# Altium project 724452_RPL-HX_Mobile_AEP_Rev0p91.PrjPcb (part 6 of 13)

## Sheet 0040_GPP_I_J_K_R_S.SchDoc
size A3
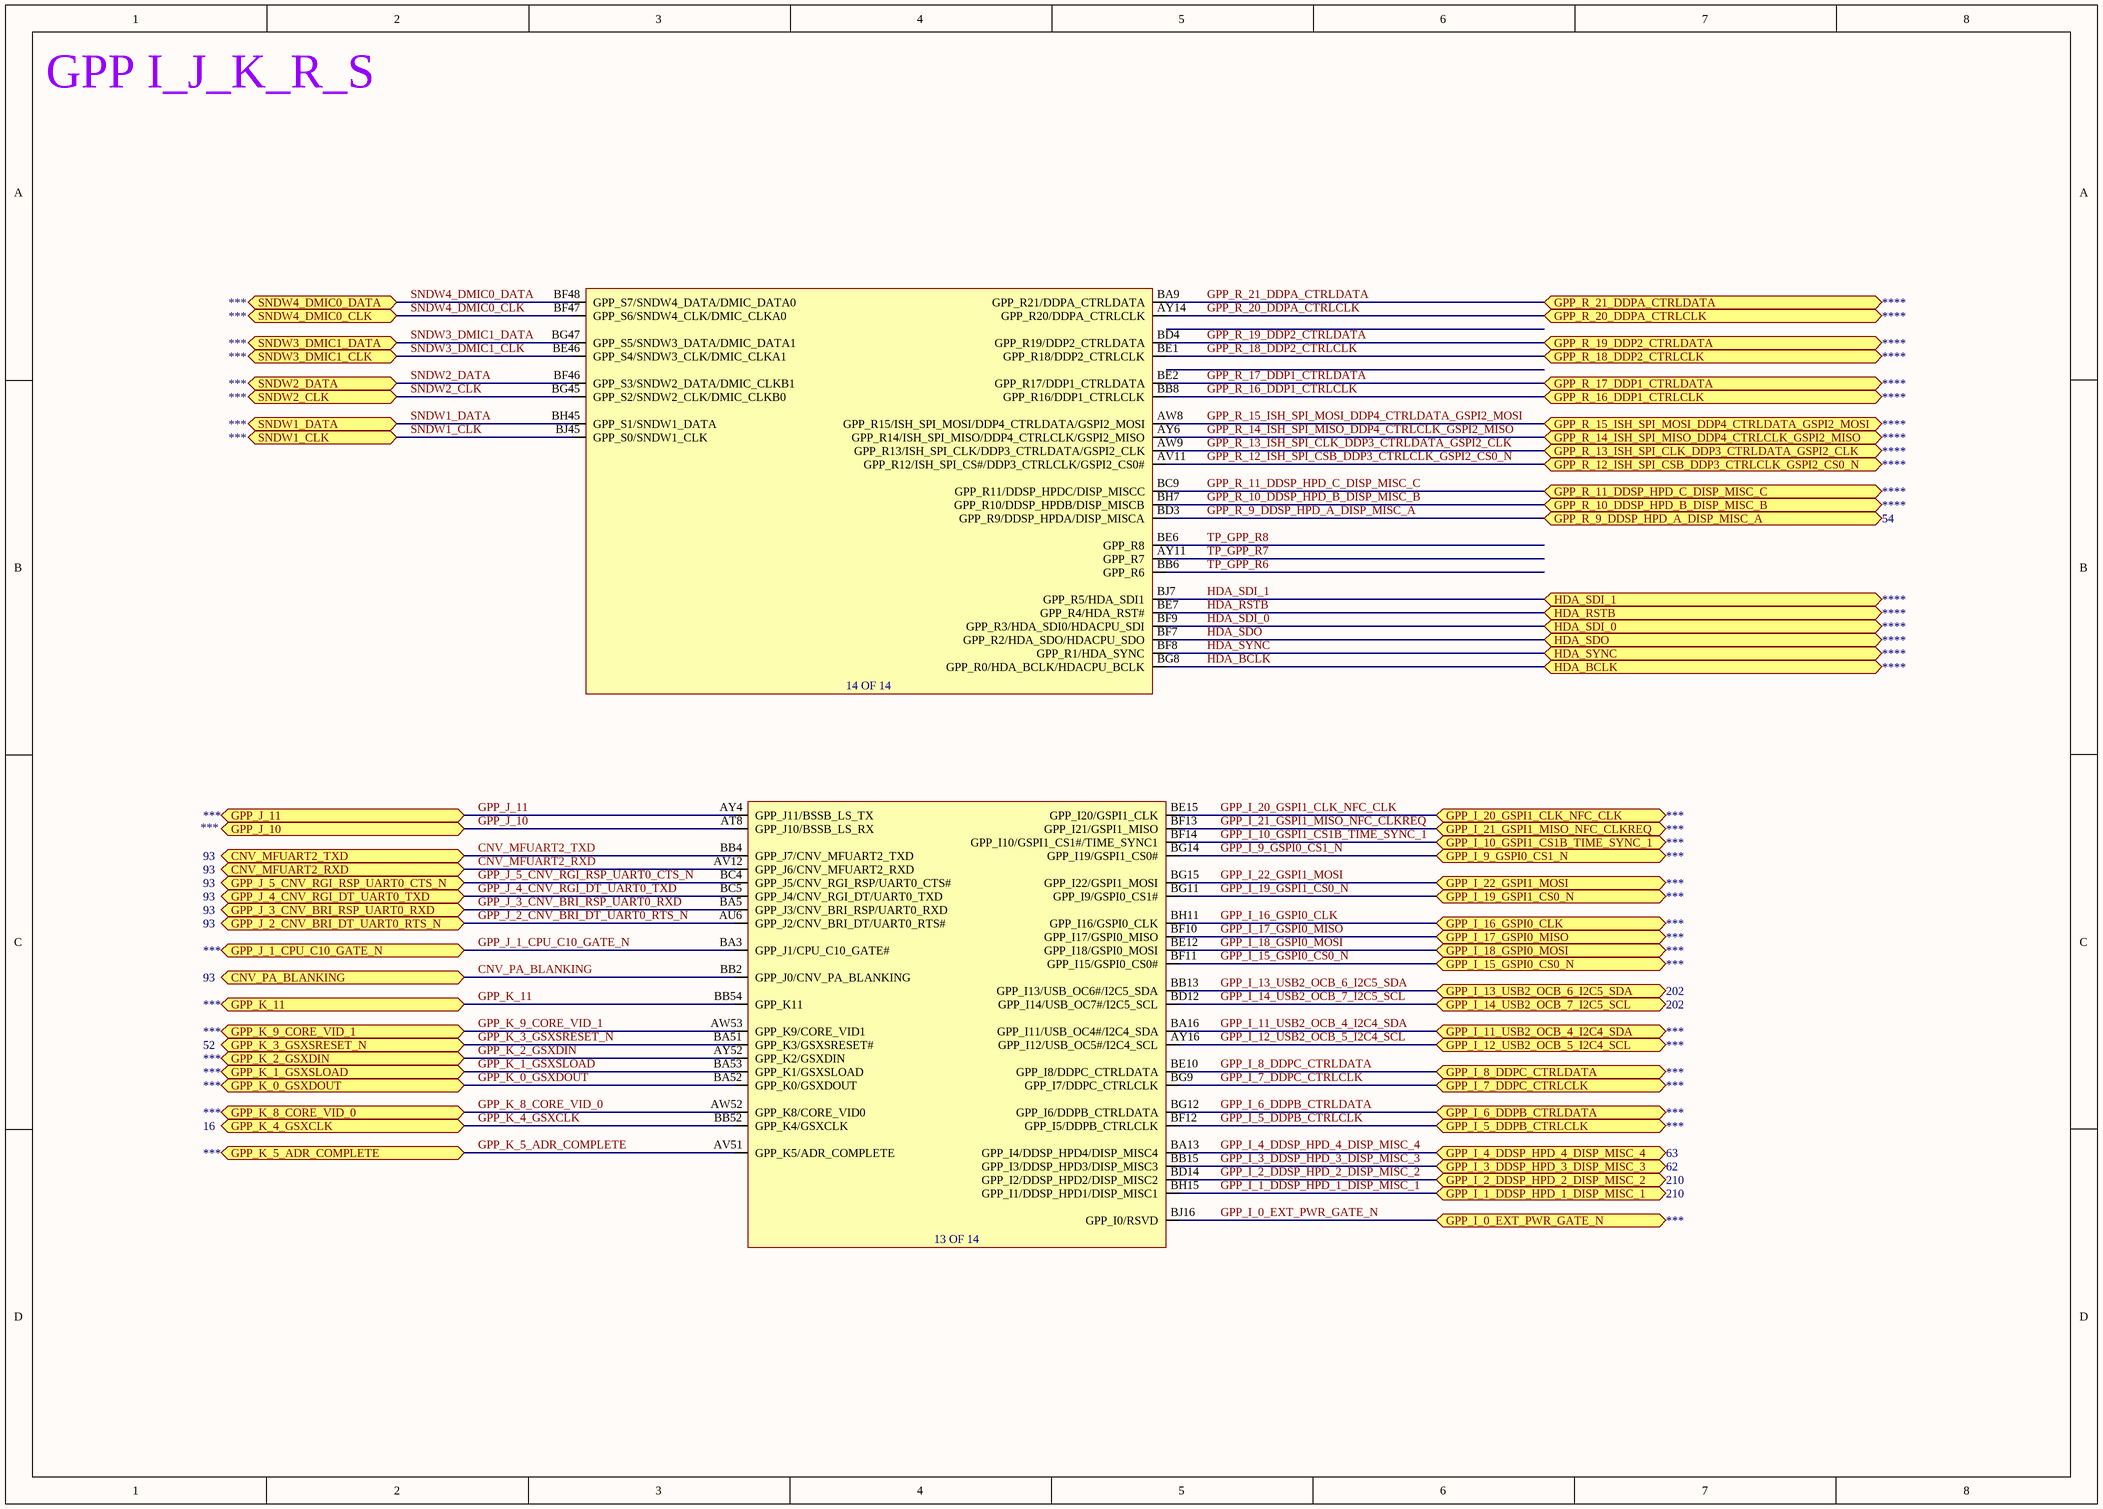
[diagram p66: 0040_GPP_I_J_K_R_S.SchDoc]

### Parts
U23601  C_RPL_S_PCH_EXT  (value not drawn)  (parts M,N of 14)

### Ports
CNV_MFUART2_RXD (bidir), CNV_MFUART2_TXD (bidir), CNV_PA_BLANKING (bidir), GPP_I_0_EXT_PWR_GATE_N (bidir), GPP_I_1_DDSP_HPD_1_DISP_MISC_1 (bidir), GPP_I_2_DDSP_HPD_2_DISP_MISC_2 (bidir), GPP_I_3_DDSP_HPD_3_DISP_MISC_3 (bidir), GPP_I_4_DDSP_HPD_4_DISP_MISC_4 (bidir), GPP_I_5_DDPB_CTRLCLK (bidir), GPP_I_6_DDPB_CTRLDATA (bidir), GPP_I_7_DDPC_CTRLCLK (bidir), GPP_I_8_DDPC_CTRLDATA (bidir), GPP_I_9_GSPI0_CS1_N (bidir), GPP_I_10_GSPI1_CS1B_TIME_SYNC_1 (bidir), GPP_I_11_USB2_OCB_4_I2C4_SDA (bidir), GPP_I_12_USB2_OCB_5_I2C4_SCL (bidir), GPP_I_13_USB2_OCB_6_I2C5_SDA (bidir), GPP_I_14_USB2_OCB_7_I2C5_SCL (bidir), GPP_I_15_GSPI0_CS0_N (bidir), GPP_I_16_GSPI0_CLK (bidir), GPP_I_17_GSPI0_MISO (bidir), GPP_I_18_GSPI0_MOSI (bidir), GPP_I_19_GSPI1_CS0_N (bidir), GPP_I_20_GSPI1_CLK_NFC_CLK (bidir), GPP_I_21_GSPI1_MISO_NFC_CLKREQ (bidir), GPP_I_22_GSPI1_MOSI (bidir), GPP_J_1_CPU_C10_GATE_N (bidir), GPP_J_2_CNV_BRI_DT_UART0_RTS_N (bidir), GPP_J_3_CNV_BRI_RSP_UART0_RXD (bidir), GPP_J_4_CNV_RGI_DT_UART0_TXD (bidir), GPP_J_5_CNV_RGI_RSP_UART0_CTS_N (bidir), GPP_J_10 (bidir), GPP_J_11 (bidir), GPP_K_0_GSXDOUT (bidir), GPP_K_1_GSXSLOAD (bidir), GPP_K_2_GSXDIN (bidir), GPP_K_3_GSXSRESET_N (bidir), GPP_K_4_GSXCLK (bidir), GPP_K_5_ADR_COMPLETE (bidir), GPP_K_8_CORE_VID_0 (bidir), GPP_K_9_CORE_VID_1 (bidir), GPP_K_11 (bidir), GPP_R_9_DDSP_HPD_A_DISP_MISC_A (bidir), GPP_R_10_DDSP_HPD_B_DISP_MISC_B (bidir), GPP_R_11_DDSP_HPD_C_DISP_MISC_C (bidir), GPP_R_12_ISH_SPI_CSB_DDP3_CTRLCLK_GSPI2_CS0_N (bidir), GPP_R_13_ISH_SPI_CLK_DDP3_CTRLDATA_GSPI2_CLK (bidir), GPP_R_14_ISH_SPI_MISO_DDP4_CTRLCLK_GSPI2_MISO (bidir), GPP_R_15_ISH_SPI_MOSI_DDP4_CTRLDATA_GSPI2_MOSI (bidir), GPP_R_16_DDP1_CTRLCLK (bidir), GPP_R_17_DDP1_CTRLDATA (bidir), GPP_R_18_DDP2_CTRLCLK (bidir), GPP_R_19_DDP2_CTRLDATA (bidir), GPP_R_20_DDPA_CTRLCLK (bidir), GPP_R_21_DDPA_CTRLDATA (bidir), HDA_BCLK (bidir), HDA_RSTB (bidir), HDA_SDI_0 (bidir), HDA_SDI_1 (bidir), HDA_SDO (bidir), HDA_SYNC (bidir), SNDW1_CLK (bidir), SNDW1_DATA (bidir), SNDW2_CLK (bidir), SNDW2_DATA (bidir), SNDW3_DMIC1_CLK (bidir), SNDW3_DMIC1_DATA (bidir), SNDW4_DMIC0_CLK (bidir), SNDW4_DMIC0_DATA (bidir)

### Nets
CNV_MFUART2_RXD: U23601.AV12(GPP_J6/CNV_MFUART2_RXD) ; port CNV_MFUART2_RXD
CNV_MFUART2_TXD: U23601.BB4(GPP_J7/CNV_MFUART2_TXD) ; port CNV_MFUART2_TXD
CNV_PA_BLANKING: U23601.BB2(GPP_J0/CNV_PA_BLANKING) ; port CNV_PA_BLANKING
GPP_I_0_EXT_PWR_GATE_N: U23601.BJ16(GPP_I0/RSVD) ; port GPP_I_0_EXT_PWR_GATE_N
GPP_I_1_DDSP_HPD_1_DISP_MISC_1: U23601.BH15(GPP_I1/DDSP_HPD1/DISP_MISC1) ; port GPP_I_1_DDSP_HPD_1_DISP_MISC_1
GPP_I_2_DDSP_HPD_2_DISP_MISC_2: U23601.BD14(GPP_I2/DDSP_HPD2/DISP_MISC2) ; port GPP_I_2_DDSP_HPD_2_DISP_MISC_2
GPP_I_3_DDSP_HPD_3_DISP_MISC_3: U23601.BB15(GPP_I3/DDSP_HPD3/DISP_MISC3) ; port GPP_I_3_DDSP_HPD_3_DISP_MISC_3
GPP_I_4_DDSP_HPD_4_DISP_MISC_4: U23601.BA13(GPP_I4/DDSP_HPD4/DISP_MISC4) ; port GPP_I_4_DDSP_HPD_4_DISP_MISC_4  [project net GPP_I_3_DDSP_HPD_3_DISP_MISC_3]
GPP_I_5_DDPB_CTRLCLK: U23601.BF12(GPP_I5/DDPB_CTRLCLK) ; port GPP_I_5_DDPB_CTRLCLK
GPP_I_6_DDPB_CTRLDATA: U23601.BG12(GPP_I6/DDPB_CTRLDATA) ; port GPP_I_6_DDPB_CTRLDATA
GPP_I_7_DDPC_CTRLCLK: U23601.BG9(GPP_I7/DDPC_CTRLCLK) ; port GPP_I_7_DDPC_CTRLCLK
GPP_I_8_DDPC_CTRLDATA: U23601.BE10(GPP_I8/DDPC_CTRLDATA) ; port GPP_I_8_DDPC_CTRLDATA
GPP_I_9_GSPI0_CS1_N: U23601.BG14(GPP_I19/GSPI1_CS0#) ; port GPP_I_9_GSPI0_CS1_N
GPP_I_10_GSPI1_CS1B_TIME_SYNC_1: U23601.BF14(GPP_I10/GSPI1_CS1#/TIME_SYNC1) ; port GPP_I_10_GSPI1_CS1B_TIME_SYNC_1
GPP_I_11_USB2_OCB_4_I2C4_SDA: U23601.BA16(GPP_I11/USB_OC4#/I2C4_SDA) ; port GPP_I_11_USB2_OCB_4_I2C4_SDA
GPP_I_12_USB2_OCB_5_I2C4_SCL: U23601.AY16(GPP_I12/USB_OC5#/I2C4_SCL) ; port GPP_I_12_USB2_OCB_5_I2C4_SCL
GPP_I_13_USB2_OCB_6_I2C5_SDA: U23601.BB13(GPP_I13/USB_OC6#/I2C5_SDA) ; port GPP_I_13_USB2_OCB_6_I2C5_SDA
GPP_I_14_USB2_OCB_7_I2C5_SCL: U23601.BD12(GPP_I14/USB_OC7#/I2C5_SCL) ; port GPP_I_14_USB2_OCB_7_I2C5_SCL
GPP_I_15_GSPI0_CS0_N: U23601.BF11(GPP_I15/GSPI0_CS0#) ; port GPP_I_15_GSPI0_CS0_N
GPP_I_16_GSPI0_CLK: U23601.BH11(GPP_I16/GSPI0_CLK) ; port GPP_I_16_GSPI0_CLK
GPP_I_17_GSPI0_MISO: U23601.BF10(GPP_I17/GSPI0_MISO) ; port GPP_I_17_GSPI0_MISO
GPP_I_18_GSPI0_MOSI: U23601.BE12(GPP_I18/GSPI0_MOSI) ; port GPP_I_18_GSPI0_MOSI
GPP_I_19_GSPI1_CS0_N: U23601.BG11(GPP_I9/GSPI0_CS1#) ; port GPP_I_19_GSPI1_CS0_N
GPP_I_20_GSPI1_CLK_NFC_CLK: U23601.BE15(GPP_I20/GSPI1_CLK) ; port GPP_I_20_GSPI1_CLK_NFC_CLK
GPP_I_21_GSPI1_MISO_NFC_CLKREQ: U23601.BF13(GPP_I21/GSPI1_MISO) ; port GPP_I_21_GSPI1_MISO_NFC_CLKREQ
GPP_I_22_GSPI1_MOSI: U23601.BG15(GPP_I22/GSPI1_MOSI) ; port GPP_I_22_GSPI1_MOSI
GPP_J_1_CPU_C10_GATE_N: U23601.BA3(GPP_J1/CPU_C10_GATE#) ; port GPP_J_1_CPU_C10_GATE_N
GPP_J_2_CNV_BRI_DT_UART0_RTS_N: U23601.AU6(GPP_J2/CNV_BRI_DT/UART0_RTS#) ; port GPP_J_2_CNV_BRI_DT_UART0_RTS_N
GPP_J_3_CNV_BRI_RSP_UART0_RXD: U23601.BA5(GPP_J3/CNV_BRI_RSP/UART0_RXD) ; port GPP_J_3_CNV_BRI_RSP_UART0_RXD
GPP_J_4_CNV_RGI_DT_UART0_TXD: U23601.BC5(GPP_J4/CNV_RGI_DT/UART0_TXD) ; port GPP_J_4_CNV_RGI_DT_UART0_TXD
GPP_J_5_CNV_RGI_RSP_UART0_CTS_N: U23601.BC4(GPP_J5/CNV_RGI_RSP/UART0_CTS#) ; port GPP_J_5_CNV_RGI_RSP_UART0_CTS_N
GPP_J_10: U23601.AT8(GPP_J10/BSSB_LS_RX) ; port GPP_J_10
GPP_J_11: U23601.AY4(GPP_J11/BSSB_LS_TX) ; port GPP_J_11
GPP_K_0_GSXDOUT: U23601.BA52(GPP_K0/GSXDOUT) ; port GPP_K_0_GSXDOUT
GPP_K_1_GSXSLOAD: U23601.BA53(GPP_K1/GSXSLOAD) ; port GPP_K_1_GSXSLOAD
GPP_K_2_GSXDIN: U23601.AY52(GPP_K2/GSXDIN) ; port GPP_K_2_GSXDIN
GPP_K_3_GSXSRESET_N: U23601.BA51(GPP_K3/GSXSRESET#) ; port GPP_K_3_GSXSRESET_N
GPP_K_4_GSXCLK: U23601.BB52(GPP_K4/GSXCLK) ; port GPP_K_4_GSXCLK
GPP_K_5_ADR_COMPLETE: U23601.AV51(GPP_K5/ADR_COMPLETE) ; port GPP_K_5_ADR_COMPLETE
GPP_K_8_CORE_VID_0: U23601.AW52(GPP_K8/CORE_VID0) ; port GPP_K_8_CORE_VID_0
GPP_K_9_CORE_VID_1: U23601.AW53(GPP_K9/CORE_VID1) ; port GPP_K_9_CORE_VID_1
GPP_K_11: U23601.BB54(GPP_K11) ; port GPP_K_11
GPP_R_9_DDSP_HPD_A_DISP_MISC_A: U23601.BD3(GPP_R9/DDSP_HPDA/DISP_MISCA) ; port GPP_R_9_DDSP_HPD_A_DISP_MISC_A
GPP_R_10_DDSP_HPD_B_DISP_MISC_B: U23601.BH7(GPP_R10/DDSP_HPDB/DISP_MISCB) ; port GPP_R_10_DDSP_HPD_B_DISP_MISC_B
GPP_R_11_DDSP_HPD_C_DISP_MISC_C: U23601.BC9(GPP_R11/DDSP_HPDC/DISP_MISCC) ; port GPP_R_11_DDSP_HPD_C_DISP_MISC_C
GPP_R_12_ISH_SPI_CSB_DDP3_CTRLCLK_GSPI2_CS0_N: U23601.AV11(GPP_R12/ISH_SPI_CS#/DDP3_CTRLCLK/GSPI2_CS0#) ; port GPP_R_12_ISH_SPI_CSB_DDP3_CTRLCLK_GSPI2_CS0_N
GPP_R_13_ISH_SPI_CLK_DDP3_CTRLDATA_GSPI2_CLK: U23601.AW9(GPP_R13/ISH_SPI_CLK/DDP3_CTRLDATA/GSPI2_CLK) ; port GPP_R_13_ISH_SPI_CLK_DDP3_CTRLDATA_GSPI2_CLK
GPP_R_14_ISH_SPI_MISO_DDP4_CTRLCLK_GSPI2_MISO: U23601.AY6(GPP_R14/ISH_SPI_MISO/DDP4_CTRLCLK/GSPI2_MISO) ; port GPP_R_14_ISH_SPI_MISO_DDP4_CTRLCLK_GSPI2_MISO
GPP_R_15_ISH_SPI_MOSI_DDP4_CTRLDATA_GSPI2_MOSI: U23601.AW8(GPP_R15/ISH_SPI_MOSI/DDP4_CTRLDATA/GSPI2_MOSI) ; port GPP_R_15_ISH_SPI_MOSI_DDP4_CTRLDATA_GSPI2_MOSI
GPP_R_16_DDP1_CTRLCLK: U23601.BB8(GPP_R16/DDP1_CTRLCLK) ; port GPP_R_16_DDP1_CTRLCLK
GPP_R_17_DDP1_CTRLDATA: U23601.BE2(GPP_R17/DDP1_CTRLDATA) ; port GPP_R_17_DDP1_CTRLDATA
GPP_R_18_DDP2_CTRLCLK: U23601.BE1(GPP_R18/DDP2_CTRLCLK) ; port GPP_R_18_DDP2_CTRLCLK
GPP_R_19_DDP2_CTRLDATA: U23601.BD4(GPP_R19/DDP2_CTRLDATA) ; port GPP_R_19_DDP2_CTRLDATA
GPP_R_20_DDPA_CTRLCLK: U23601.AY14(GPP_R20/DDPA_CTRLCLK) ; port GPP_R_20_DDPA_CTRLCLK
GPP_R_21_DDPA_CTRLDATA: U23601.BA9(GPP_R21/DDPA_CTRLDATA) ; port GPP_R_21_DDPA_CTRLDATA
HDA_BCLK: U23601.BG8(GPP_R0/HDA_BCLK/HDACPU_BCLK) ; port HDA_BCLK
HDA_RSTB: U23601.BE7(GPP_R4/HDA_RST#) ; port HDA_RSTB
HDA_SDI_0: U23601.BF9(GPP_R3/HDA_SDI0/HDACPU_SDI) ; port HDA_SDI_0
HDA_SDI_1: U23601.BJ7(GPP_R5/HDA_SDI1) ; port HDA_SDI_1
HDA_SDO: U23601.BF7(GPP_R2/HDA_SDO/HDACPU_SDO) ; port HDA_SDO
HDA_SYNC: U23601.BF8(GPP_R1/HDA_SYNC) ; port HDA_SYNC
SNDW1_CLK: U23601.BJ45(GPP_S0/SNDW1_CLK) ; port SNDW1_CLK
SNDW1_DATA: U23601.BH45(GPP_S1/SNDW1_DATA) ; port SNDW1_DATA
SNDW2_CLK: U23601.BG45(GPP_S2/SNDW2_CLK/DMIC_CLKB0) ; port SNDW2_CLK
SNDW2_DATA: U23601.BF46(GPP_S3/SNDW2_DATA/DMIC_CLKB1) ; port SNDW2_DATA
SNDW3_DMIC1_CLK: U23601.BE46(GPP_S4/SNDW3_CLK/DMIC_CLKA1) ; port SNDW3_DMIC1_CLK
SNDW3_DMIC1_DATA: U23601.BG47(GPP_S5/SNDW3_DATA/DMIC_DATA1) ; port SNDW3_DMIC1_DATA
SNDW4_DMIC0_CLK: U23601.BF47(GPP_S6/SNDW4_CLK/DMIC_CLKA0) ; port SNDW4_DMIC0_CLK
SNDW4_DMIC0_DATA: U23601.BF48(GPP_S7/SNDW4_DATA/DMIC_DATA0) ; port SNDW4_DMIC0_DATA
TP_GPP_R6: U23601.BB6(GPP_R6)
TP_GPP_R7: U23601.AY11(GPP_R7)
TP_GPP_R8: U23601.BE6(GPP_R8)

### Notes on the sheet
- GPP I_J_K_R_S
- (in symbol C_RPL_S_PCH_EXT, part M) 13 OF 14
- (in symbol C_RPL_S_PCH_EXT, part N) 14 OF 14

### Library data of the parts
U23601 = C_RPL_S_PCH_EXT: Manufacturer Part Number: *; Case/Package: *

## Sheet 0041_PCH_PWR_GND.SchDoc
size 848 x 558 mm
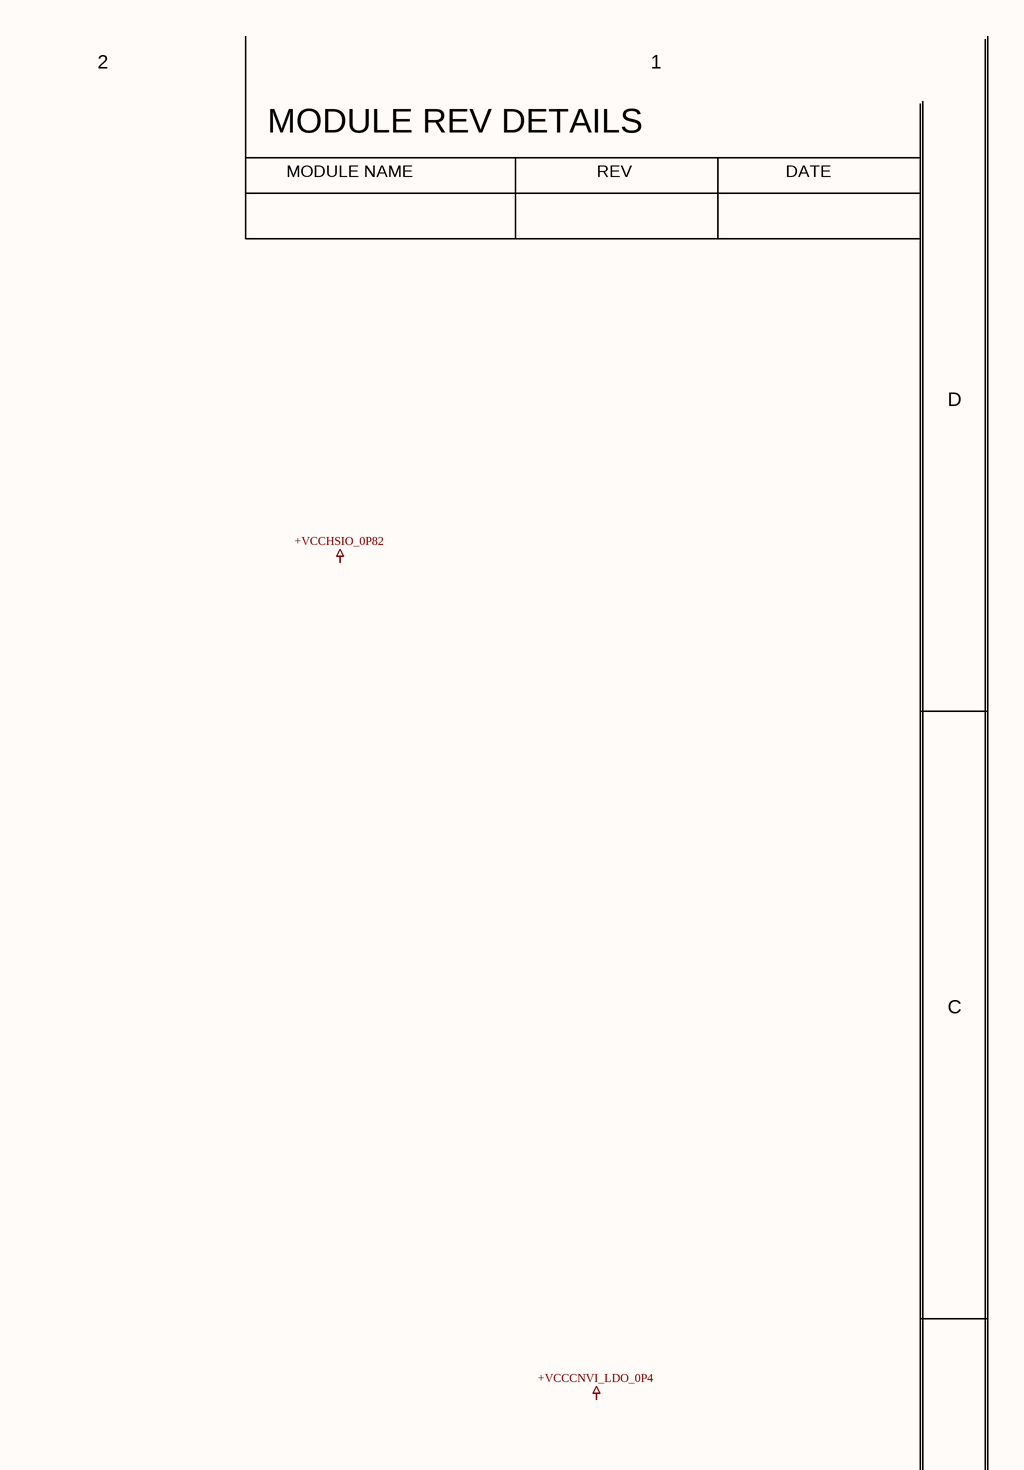
[diagram p67: 0041_PCH_PWR_GND.SchDoc, top right]
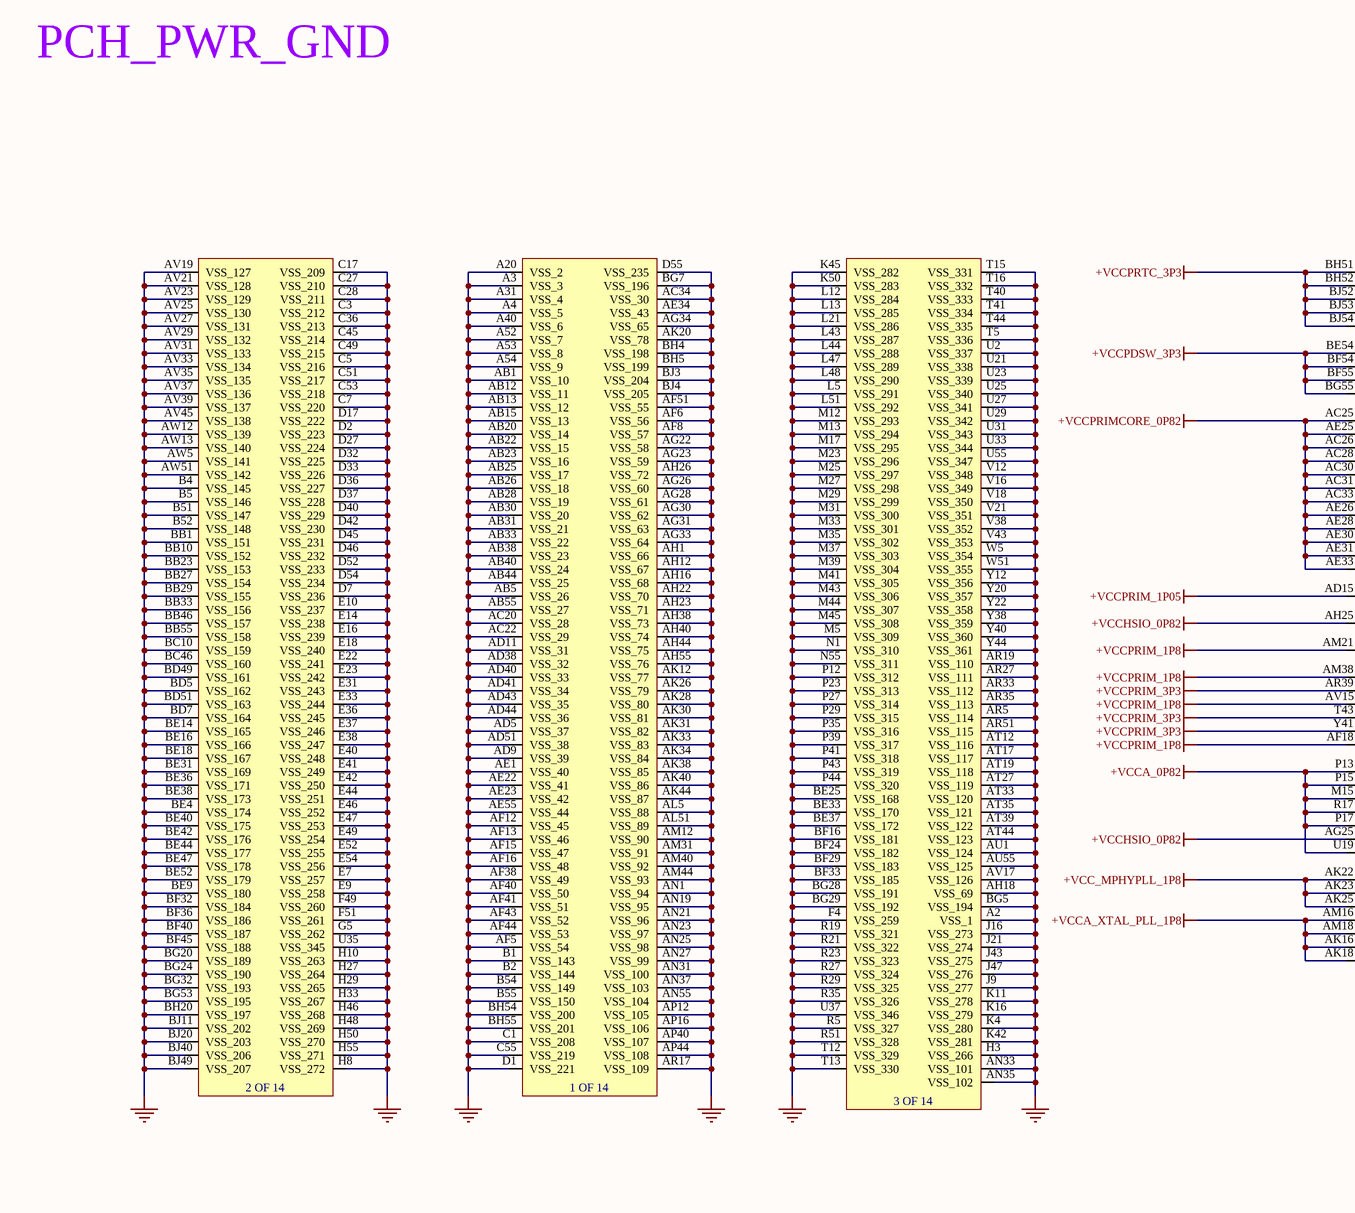
[diagram p68: 0041_PCH_PWR_GND.SchDoc, bottom left]
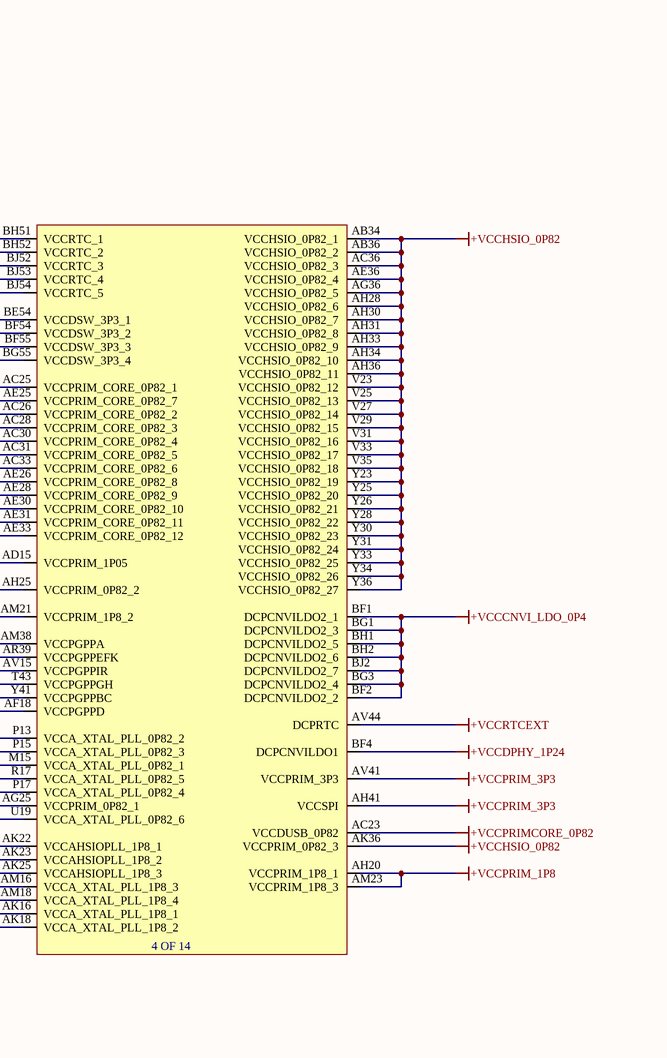
[diagram p69: 0041_PCH_PWR_GND.SchDoc, bottom middle]
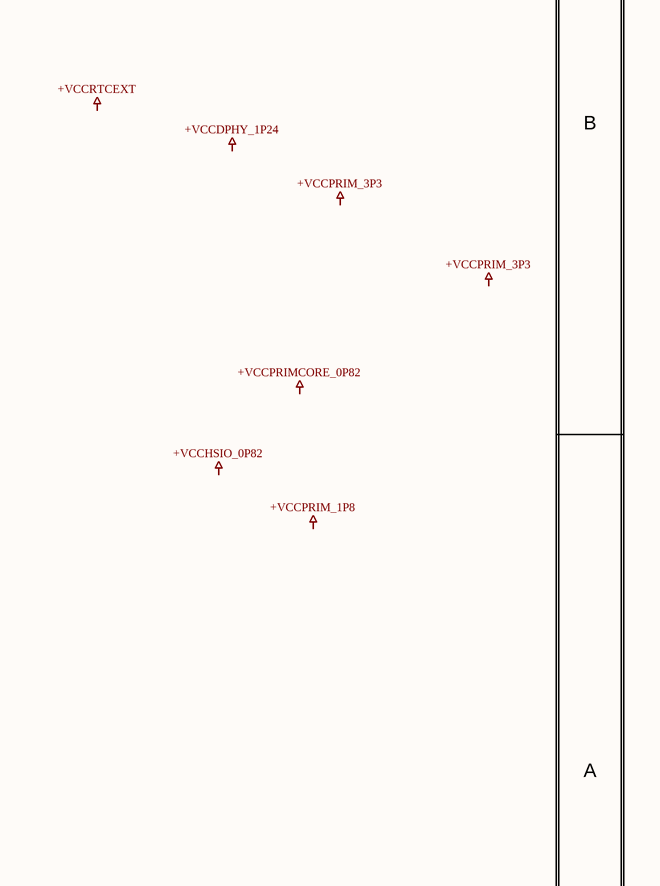
[diagram p70: 0041_PCH_PWR_GND.SchDoc, bottom right]

### Parts
(Parts that share a designator on the sheet are numbered #1, #2 ... from top to bottom, then left to right.)
U23601  C_RPL_S_PCH_EXT  (value not drawn)  (parts A,B,C of 14)
U?#4  C_RPL_S_PCH_EXT  (value not drawn)  (part D of 14)

### Nets
+VCC_MPHYPLL_1P8: U?#4.AK22(VCCAHSIOPLL_1P8_1) U?#4.AK23(VCCAHSIOPLL_1P8_2) U?#4.AK25(VCCAHSIOPLL_1P8_3)
+VCCA_0P82: U?#4.M15(VCCA_XTAL_PLL_0P82_1) U?#4.P13(VCCA_XTAL_PLL_0P82_2) U?#4.P15(VCCA_XTAL_PLL_0P82_3) U?#4.P17(VCCA_XTAL_PLL_0P82_4) U?#4.R17(VCCA_XTAL_PLL_0P82_5) U?#4.U19(VCCA_XTAL_PLL_0P82_6)
+VCCA_XTAL_PLL_1P8: U?#4.AK16(VCCA_XTAL_PLL_1P8_1) U?#4.AK18(VCCA_XTAL_PLL_1P8_2) U?#4.AM16(VCCA_XTAL_PLL_1P8_3) U?#4.AM18(VCCA_XTAL_PLL_1P8_4)
+VCCCNVI_LDO_0P4: U?#4.BF1(DCPCNVILDO2_1) U?#4.BF2(DCPCNVILDO2_2) U?#4.BG1(DCPCNVILDO2_3) U?#4.BG3(DCPCNVILDO2_4) U?#4.BH1(DCPCNVILDO2_5) U?#4.BH2(DCPCNVILDO2_6) U?#4.BJ2(DCPCNVILDO2_7)
+VCCDPHY_1P24: U?#4.BF4(DCPCNVILDO1)
+VCCHSIO_0P82: U?#4.AB34(VCCHSIO_0P82_1) U?#4.AB36(VCCHSIO_0P82_2) U?#4.AC36(VCCHSIO_0P82_3) U?#4.AE36(VCCHSIO_0P82_4) U?#4.AG25(VCCPRIM_0P82_1) U?#4.AG36(VCCHSIO_0P82_5) U?#4.AH25(VCCPRIM_0P82_2) U?#4.AH28(VCCHSIO_0P82_6) U?#4.AH30(VCCHSIO_0P82_7) U?#4.AH31(VCCHSIO_0P82_8) U?#4.AH33(VCCHSIO_0P82_9) U?#4.AH34(VCCHSIO_0P82_10) U?#4.AH36(VCCHSIO_0P82_11) U?#4.AK36(VCCPRIM_0P82_3) U?#4.V23(VCCHSIO_0P82_12) U?#4.V25(VCCHSIO_0P82_13) U?#4.V27(VCCHSIO_0P82_14) U?#4.V29(VCCHSIO_0P82_15) U?#4.V31(VCCHSIO_0P82_16) U?#4.V33(VCCHSIO_0P82_17) U?#4.V35(VCCHSIO_0P82_18) U?#4.Y23(VCCHSIO_0P82_19) U?#4.Y25(VCCHSIO_0P82_20) U?#4.Y26(VCCHSIO_0P82_21) U?#4.Y28(VCCHSIO_0P82_22) U?#4.Y30(VCCHSIO_0P82_23) U?#4.Y31(VCCHSIO_0P82_24) U?#4.Y33(VCCHSIO_0P82_25) U?#4.Y34(VCCHSIO_0P82_26) U?#4.Y36(VCCHSIO_0P82_27)
+VCCPDSW_3P3: U?#4.BE54(VCCDSW_3P3_1) U?#4.BF54(VCCDSW_3P3_2) U?#4.BF55(VCCDSW_3P3_3) U?#4.BG55(VCCDSW_3P3_4)
+VCCPRIM_1P05: U?#4.AD15(VCCPRIM_1P05)
+VCCPRIM_1P8: U?#4.AF18(VCCPGPPD) U?#4.AH20(VCCPRIM_1P8_1) U?#4.AM21(VCCPRIM_1P8_2) U?#4.AM23(VCCPRIM_1P8_3) U?#4.AM38(VCCPGPPA) U?#4.AV15(VCCPGPPIR)
+VCCPRIM_3P3: U?#4.AH41(VCCSPI) U?#4.AR39(VCCPGPPEFK) U?#4.AV41(VCCPRIM_3P3) U?#4.T43(VCCPGPPGH) U?#4.Y41(VCCPGPPBC)
+VCCPRIMCORE_0P82: U?#4.AC23(VCCDUSB_0P82) U?#4.AC25(VCCPRIM_CORE_0P82_1) U?#4.AC26(VCCPRIM_CORE_0P82_2) U?#4.AC28(VCCPRIM_CORE_0P82_3) U?#4.AC30(VCCPRIM_CORE_0P82_4) U?#4.AC31(VCCPRIM_CORE_0P82_5) U?#4.AC33(VCCPRIM_CORE_0P82_6) U?#4.AE25(VCCPRIM_CORE_0P82_7) U?#4.AE26(VCCPRIM_CORE_0P82_8) U?#4.AE28(VCCPRIM_CORE_0P82_9) U?#4.AE30(VCCPRIM_CORE_0P82_10) U?#4.AE31(VCCPRIM_CORE_0P82_11) U?#4.AE33(VCCPRIM_CORE_0P82_12)
+VCCPRTC_3P3: U?#4.BH51(VCCRTC_1) U?#4.BH52(VCCRTC_2) U?#4.BJ52(VCCRTC_3) U?#4.BJ53(VCCRTC_4) U?#4.BJ54(VCCRTC_5)
+VCCRTCEXT: U?#4.AV44(DCPRTC)
GND: U23601.A2(VSS_1) U23601.A3(VSS_3) U23601.A4(VSS_5) U23601.A20(VSS_2) U23601.A31(VSS_4) U23601.A40(VSS_6) U23601.A52(VSS_7) U23601.A53(VSS_8) U23601.A54(VSS_9) U23601.AB1(VSS_10) U23601.AB5(VSS_26) U23601.AB12(VSS_11) U23601.AB13(VSS_12) U23601.AB15(VSS_13) U23601.AB20(VSS_14) U23601.AB22(VSS_15) U23601.AB23(VSS_16) U23601.AB25(VSS_17) U23601.AB26(VSS_18) U23601.AB28(VSS_19) U23601.AB30(VSS_20) U23601.AB31(VSS_21) U23601.AB33(VSS_22) U23601.AB38(VSS_23) U23601.AB40(VSS_24) U23601.AB44(VSS_25) U23601.AB55(VSS_27) U23601.AC20(VSS_28) U23601.AC22(VSS_29) U23601.AC34(VSS_30) U23601.AD5(VSS_37) U23601.AD9(VSS_39) U23601.AD11(VSS_31) U23601.AD38(VSS_32) U23601.AD40(VSS_33) U23601.AD41(VSS_34) U23601.AD43(VSS_35) U23601.AD44(VSS_36) U23601.AD51(VSS_38) U23601.AE1(VSS_40) U23601.AE22(VSS_41) U23601.AE23(VSS_42) U23601.AE34(VSS_43) U23601.AE55(VSS_44) U23601.AF5(VSS_54) U23601.AF6(VSS_56) U23601.AF8(VSS_57) U23601.AF12(VSS_45) U23601.AF13(VSS_46) U23601.AF15(VSS_47) U23601.AF16(VSS_48) U23601.AF38(VSS_49) U23601.AF40(VSS_50) U23601.AF41(VSS_51) U23601.AF43(VSS_52) U23601.AF44(VSS_53) U23601.AF51(VSS_55) U23601.AG22(VSS_58) U23601.AG23(VSS_59) U23601.AG26(VSS_60) U23601.AG28(VSS_61) U23601.AG30(VSS_62) U23601.AG31(VSS_63) U23601.AG33(VSS_64) U23601.AG34(VSS_65) U23601.AH1(VSS_66) U23601.AH12(VSS_67) U23601.AH16(VSS_68) U23601.AH18(VSS_69) U23601.AH22(VSS_70) U23601.AH23(VSS_71) U23601.AH26(VSS_72) U23601.AH38(VSS_73) U23601.AH40(VSS_74) U23601.AH44(VSS_75) U23601.AH55(VSS_76) U23601.AK12(VSS_77) U23601.AK20(VSS_78) U23601.AK26(VSS_79) U23601.AK28(VSS_80) U23601.AK30(VSS_81) U23601.AK31(VSS_82) U23601.AK33(VSS_83) U23601.AK34(VSS_84) U23601.AK38(VSS_85) U23601.AK40(VSS_86) U23601.AK44(VSS_87) U23601.AL5(VSS_88) U23601.AL51(VSS_89) U23601.AM12(VSS_90) U23601.AM31(VSS_91) U23601.AM40(VSS_92) U23601.AM44(VSS_93) U23601.AN1(VSS_94) U23601.AN19(VSS_95) U23601.AN21(VSS_96) U23601.AN23(VSS_97) U23601.AN25(VSS_98) U23601.AN27(VSS_99) U23601.AN31(VSS_100) U23601.AN33(VSS_101) U23601.AN35(VSS_102) U23601.AN37(VSS_103) U23601.AN55(VSS_104) U23601.AP12(VSS_105) U23601.AP16(VSS_106) U23601.AP40(VSS_107) U23601.AP44(VSS_108) U23601.AR5(VSS_114) U23601.AR17(VSS_109) U23601.AR19(VSS_110) U23601.AR27(VSS_111) U23601.AR33(VSS_112) U23601.AR35(VSS_113) U23601.AR51(VSS_115) U23601.AT12(VSS_116) U23601.AT17(VSS_117) U23601.AT19(VSS_118) U23601.AT27(VSS_119) U23601.AT33(VSS_120) U23601.AT35(VSS_121) U23601.AT39(VSS_122) U23601.AT44(VSS_123) U23601.AU1(VSS_124) U23601.AU55(VSS_125) U23601.AV17(VSS_126) U23601.AV19(VSS_127) U23601.AV21(VSS_128) U23601.AV23(VSS_129) U23601.AV25(VSS_130) U23601.AV27(VSS_131) U23601.AV29(VSS_132) U23601.AV31(VSS_133) U23601.AV33(VSS_134) U23601.AV35(VSS_135) U23601.AV37(VSS_136) U23601.AV39(VSS_137) U23601.AV45(VSS_138) U23601.AW5(VSS_141) U23601.AW12(VSS_139) U23601.AW13(VSS_140) U23601.AW51(VSS_142) U23601.B1(VSS_143) U23601.B2(VSS_144) U23601.B4(VSS_145) U23601.B5(VSS_146) U23601.B51(VSS_147) U23601.B52(VSS_148) U23601.B54(VSS_149) U23601.B55(VSS_150) U23601.BB1(VSS_151) U23601.BB10(VSS_152) U23601.BB23(VSS_153) U23601.BB27(VSS_154) U23601.BB29(VSS_155) U23601.BB33(VSS_156) U23601.BB46(VSS_157) U23601.BB55(VSS_158) U23601.BC10(VSS_159) U23601.BC46(VSS_160) U23601.BD5(VSS_162) U23601.BD7(VSS_164) U23601.BD49(VSS_161) U23601.BD51(VSS_163) U23601.BE4(VSS_174) U23601.BE9(VSS_180) U23601.BE14(VSS_165) U23601.BE16(VSS_166) U23601.BE18(VSS_167) U23601.BE25(VSS_168) U23601.BE31(VSS_169) U23601.BE33(VSS_170) U23601.BE36(VSS_171) U23601.BE37(VSS_172) U23601.BE38(VSS_173) U23601.BE40(VSS_175) U23601.BE42(VSS_176) U23601.BE44(VSS_177) U23601.BE47(VSS_178) U23601.BE52(VSS_179) U23601.BF16(VSS_181) U23601.BF24(VSS_182) U23601.BF29(VSS_183) U23601.BF32(VSS_184) U23601.BF33(VSS_185) U23601.BF36(VSS_186) U23601.BF40(VSS_187) U23601.BF45(VSS_188) U23601.BG5(VSS_194) U23601.BG7(VSS_196) U23601.BG20(VSS_189) U23601.BG24(VSS_190) U23601.BG28(VSS_191) U23601.BG29(VSS_192) U23601.BG32(VSS_193) U23601.BG53(VSS_195) U23601.BH4(VSS_198) U23601.BH5(VSS_199) U23601.BH20(VSS_197) U23601.BH54(VSS_200) U23601.BH55(VSS_201) U23601.BJ3(VSS_204) U23601.BJ4(VSS_205) U23601.BJ11(VSS_202) U23601.BJ20(VSS_203) U23601.BJ40(VSS_206) U23601.BJ49(VSS_207) U23601.C1(VSS_208) U23601.C3(VSS_212) U23601.C5(VSS_216) U23601.C7(VSS_220) U23601.C17(VSS_209) U23601.C27(VSS_210) U23601.C28(VSS_211) U23601.C36(VSS_213) U23601.C45(VSS_214) U23601.C49(VSS_215) U23601.C51(VSS_217) U23601.C53(VSS_218) U23601.C55(VSS_219) U23601.D1(VSS_221) U23601.D2(VSS_223) U23601.D7(VSS_236) U23601.D17(VSS_222) U23601.D27(VSS_224) U23601.D32(VSS_225) U23601.D33(VSS_226) U23601.D36(VSS_227) U23601.D37(VSS_228) U23601.D40(VSS_229) U23601.D42(VSS_230) U23601.D45(VSS_231) U23601.D46(VSS_232) U23601.D52(VSS_233) U23601.D54(VSS_234) U23601.D55(VSS_235) U23601.E7(VSS_257) U23601.E9(VSS_258) U23601.E10(VSS_237) U23601.E14(VSS_238) U23601.E16(VSS_239) U23601.E18(VSS_240) U23601.E22(VSS_241) U23601.E23(VSS_242) U23601.E31(VSS_243) U23601.E33(VSS_244) U23601.E36(VSS_245) U23601.E37(VSS_246) U23601.E38(VSS_247) U23601.E40(VSS_248) U23601.E41(VSS_249) U23601.E42(VSS_250) U23601.E44(VSS_251) U23601.E46(VSS_252) U23601.E47(VSS_253) U23601.E49(VSS_254) U23601.E52(VSS_255) U23601.E54(VSS_256) U23601.F4(VSS_259) U23601.F49(VSS_260) U23601.F51(VSS_261) U23601.G5(VSS_262) U23601.H3(VSS_266) U23601.H8(VSS_272) U23601.H10(VSS_263) U23601.H27(VSS_264) U23601.H29(VSS_265) U23601.H33(VSS_267) U23601.H46(VSS_268) U23601.H48(VSS_269) U23601.H50(VSS_270) U23601.H55(VSS_271) U23601.J9(VSS_277) U23601.J16(VSS_273) U23601.J21(VSS_274) U23601.J43(VSS_275) U23601.J47(VSS_276) U23601.K4(VSS_280) U23601.K11(VSS_278) U23601.K16(VSS_279) U23601.K42(VSS_281) U23601.K45(VSS_282) U23601.K50(VSS_283) U23601.L5(VSS_291) U23601.L12(VSS_284) U23601.L13(VSS_285) U23601.L21(VSS_286) U23601.L43(VSS_287) U23601.L44(VSS_288) U23601.L47(VSS_289) U23601.L48(VSS_290) U23601.L51(VSS_292) U23601.M5(VSS_309) U23601.M12(VSS_293) U23601.M13(VSS_294) U23601.M17(VSS_295) U23601.M23(VSS_296) U23601.M25(VSS_297) U23601.M27(VSS_298) U23601.M29(VSS_299) U23601.M31(VSS_300) U23601.M33(VSS_301) U23601.M35(VSS_302) U23601.M37(VSS_303) U23601.M39(VSS_304) U23601.M41(VSS_305) U23601.M43(VSS_306) U23601.M44(VSS_307) U23601.M45(VSS_308) U23601.N1(VSS_310) U23601.N55(VSS_311) U23601.P12(VSS_312) U23601.P23(VSS_313) U23601.P27(VSS_314) U23601.P29(VSS_315) U23601.P35(VSS_316) U23601.P39(VSS_317) U23601.P41(VSS_318) U23601.P43(VSS_319) U23601.P44(VSS_320) U23601.R5(VSS_327) U23601.R19(VSS_321) U23601.R21(VSS_322) U23601.R23(VSS_323) U23601.R27(VSS_324) U23601.R29(VSS_325) U23601.R35(VSS_326) U23601.R51(VSS_328) U23601.T5(VSS_336) U23601.T12(VSS_329) U23601.T13(VSS_330) U23601.T15(VSS_331) U23601.T16(VSS_332) U23601.T40(VSS_333) U23601.T41(VSS_334) U23601.T44(VSS_335) U23601.U2(VSS_337) U23601.U21(VSS_338) U23601.U23(VSS_339) U23601.U25(VSS_340) U23601.U27(VSS_341) U23601.U29(VSS_342) U23601.U31(VSS_343) U23601.U33(VSS_344) U23601.U35(VSS_345) U23601.U37(VSS_346) U23601.U55(VSS_347) U23601.V12(VSS_348) U23601.V16(VSS_349) U23601.V18(VSS_350) U23601.V21(VSS_351) U23601.V38(VSS_352) U23601.V43(VSS_353) U23601.W5(VSS_354) U23601.W51(VSS_355) U23601.Y12(VSS_356) U23601.Y20(VSS_357) U23601.Y22(VSS_358) U23601.Y38(VSS_359) U23601.Y40(VSS_360) U23601.Y44(VSS_361)  [project net EXP_A_RX_4_DP]

### Notes on the sheet
- 2
- 1
- MODULE REV DETAILS
- MODULE NAME
- REV
- DATE
- D
- C
- PCH_PWR_GND
- B
- A
- Labels drawn without touching a wire or pin: +VCCCNVI_LDO_0P4, +VCCDPHY_1P24, +VCCHSIO_0P82, +VCCPRIM_1P8, +VCCPRIM_3P3, +VCCPRIMCORE_0P82, +VCCRTCEXT
- (in symbol C_RPL_S_PCH_EXT, part A) 1 OF 14
- (in symbol C_RPL_S_PCH_EXT, part B) 2 OF 14
- (in symbol C_RPL_S_PCH_EXT, part C) 3 OF 14
- (in symbol C_RPL_S_PCH_EXT, part D) 4 OF 14

### Library data of the parts
U23601 U?#4 = C_RPL_S_PCH_EXT: Manufacturer Part Number: *; Case/Package: *

## Sheet 0042_PCH_PI_BOM.SchDoc
size 848 x 558 mm
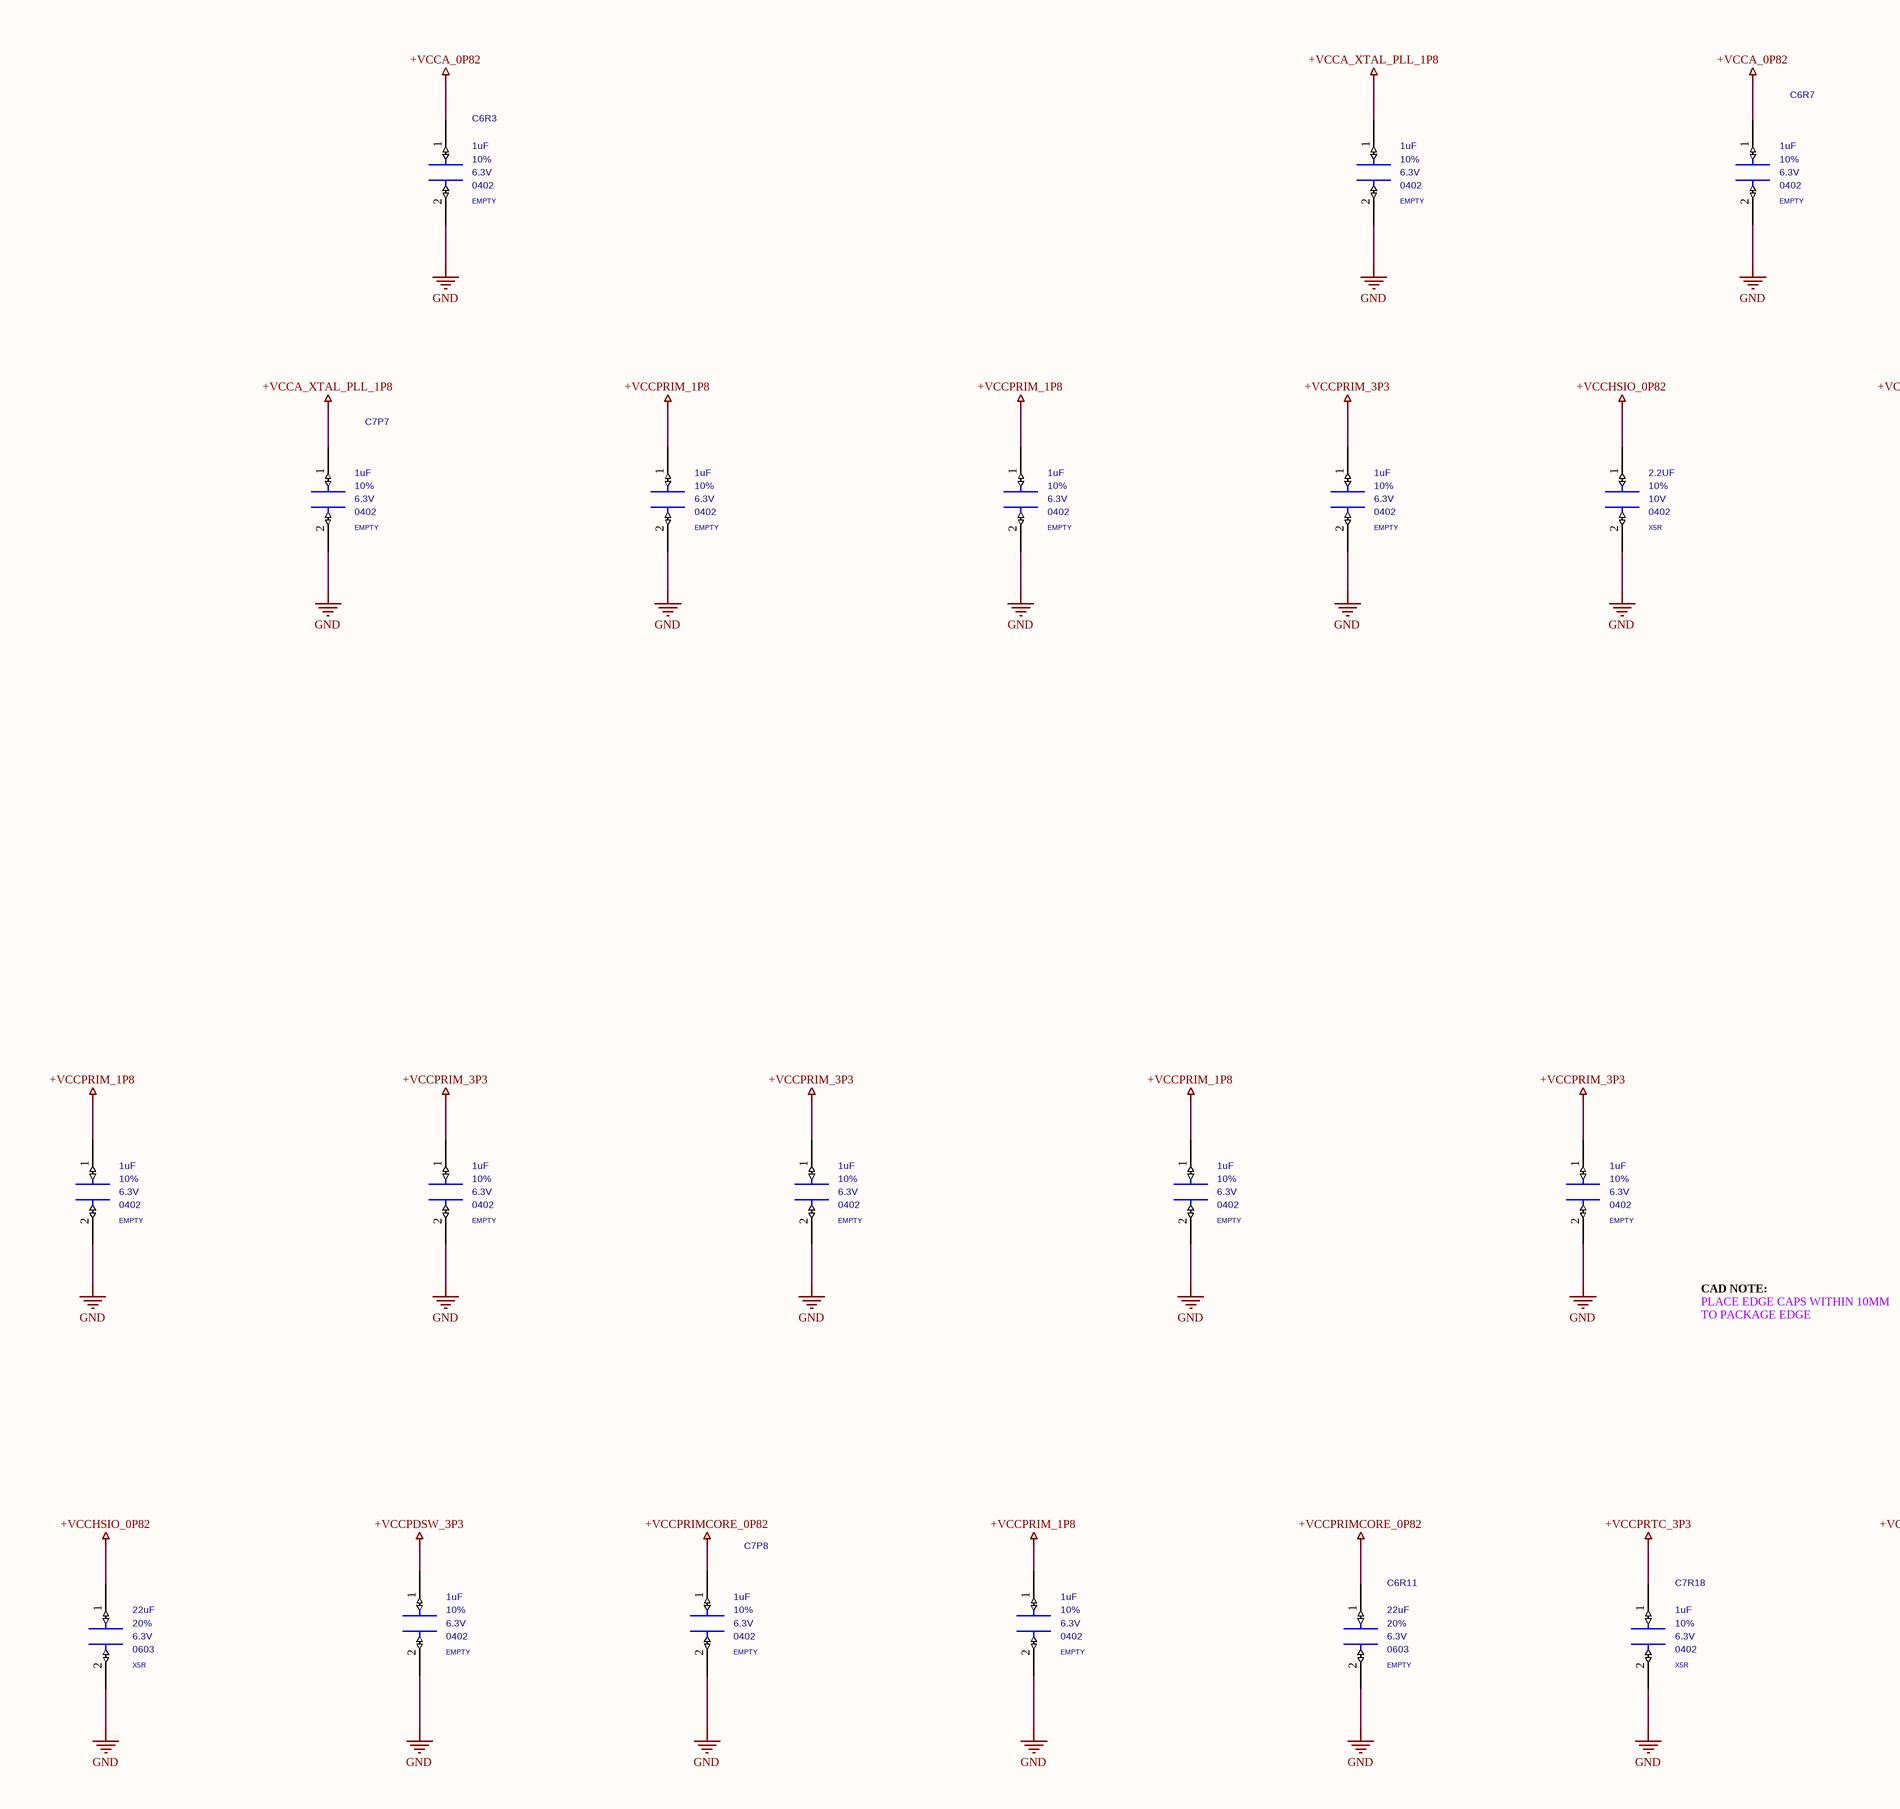
[diagram p71: 0042_PCH_PI_BOM.SchDoc, left]
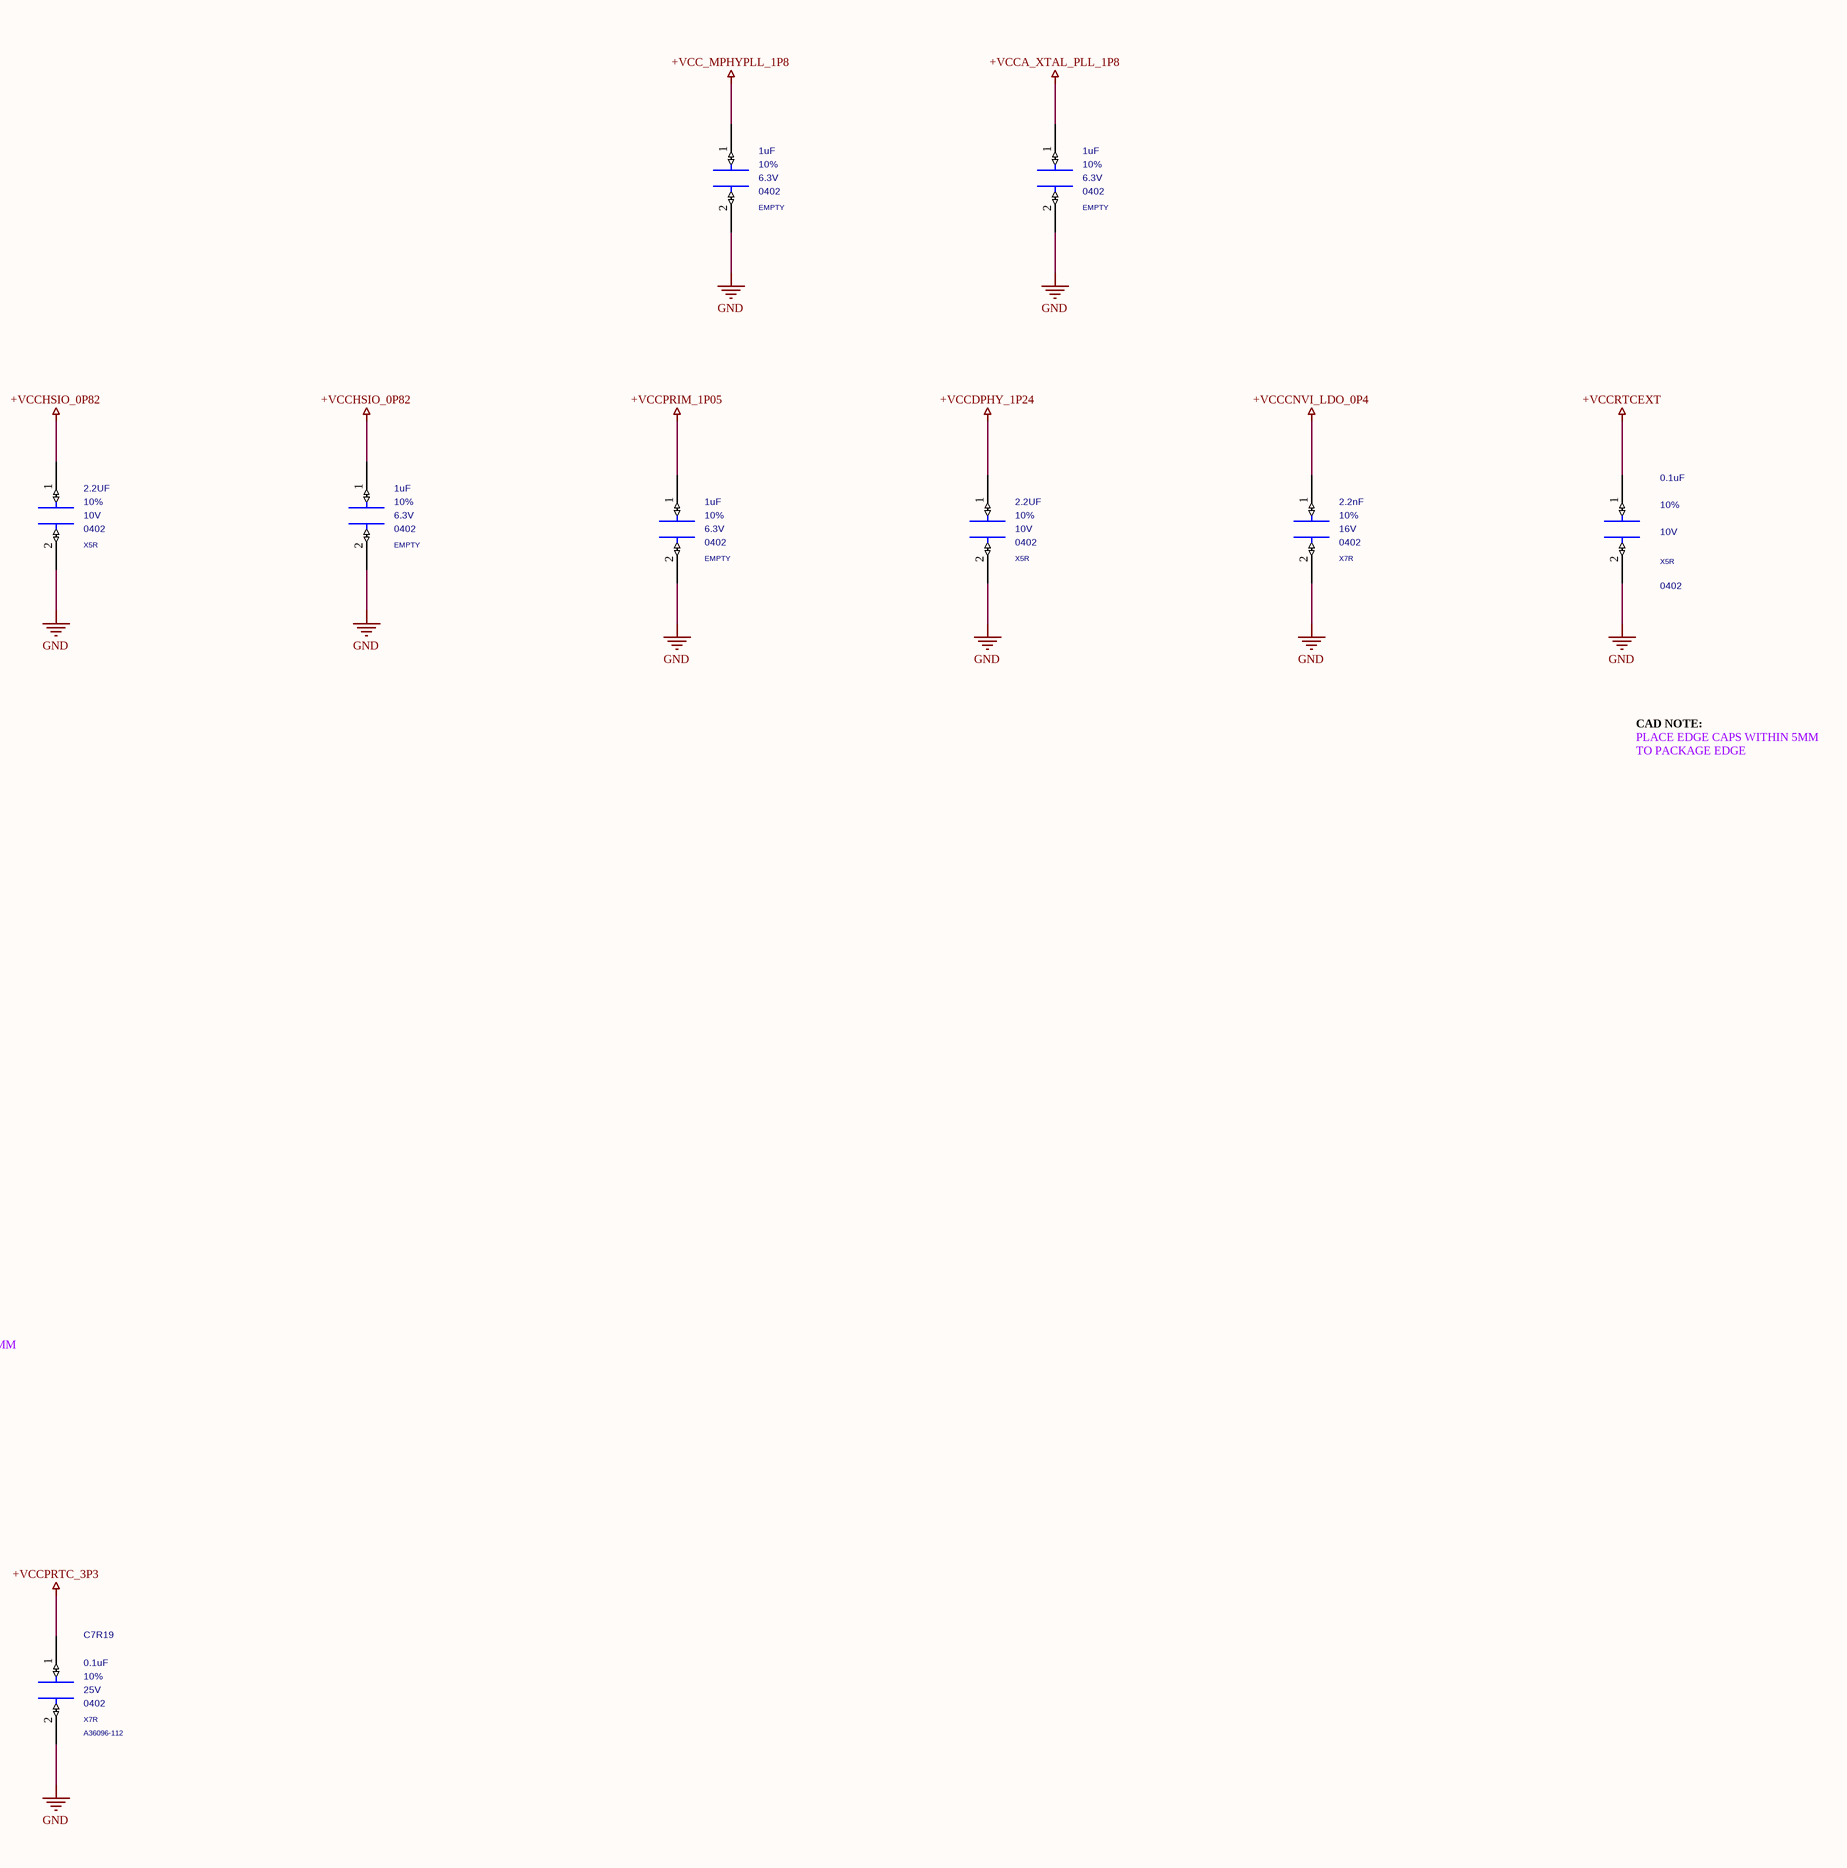
[diagram p72: 0042_PCH_PI_BOM.SchDoc, right]

### Parts
C6F1  2.2UF  MATERIAL: X5R  PACK_TYPE: 0402  TOLERANCE: 10%  VOLTAGE: 10V  [SMC0402IA]
C6F2  2.2UF  MATERIAL: X5R  PACK_TYPE: 0402  TOLERANCE: 10%  VOLTAGE: 10V  [SMC0402IA]
C6F3  22uF  MATERIAL: X5R  PACK_TYPE: 0603  TOLERANCE: 20%  VOLTAGE: 6.3V  [SMC0603ID]
C6R3  1uF  MATERIAL: EMPTY  PACK_TYPE: 0402  TOLERANCE: 10%  VOLTAGE: 6.3V  [SMC0402IA]
C6R7  1uF  MATERIAL: EMPTY  PACK_TYPE: 0402  TOLERANCE: 10%  VOLTAGE: 6.3V  [SMC0402IA]
C6R11  22uF  MATERIAL: EMPTY  PACK_TYPE: 0603  TOLERANCE: 20%  VOLTAGE: 6.3V  [SMC0603ID]
C7E1  2.2nF  MATERIAL: X7R  PACK_TYPE: 0402  TOLERANCE: 10%  VOLTAGE: 16V  [SMC0402IA]
C7F1  1uF  MATERIAL: EMPTY  PACK_TYPE: 0402  TOLERANCE: 10%  VOLTAGE: 6.3V  [SMC0402IA]
C7F2  0.1uF  MATERIAL: X5R  PACK_TYPE: 0402  TOLERANCE: 10%  VOLTAGE: 10V  [SMC0402IA]
C7P7  1uF  MATERIAL: EMPTY  PACK_TYPE: 0402  TOLERANCE: 10%  VOLTAGE: 6.3V  [SMC0402IA]
C7P8  1uF  MATERIAL: EMPTY  PACK_TYPE: 0402  TOLERANCE: 10%  VOLTAGE: 6.3V  [SMC0402IA]
C7R1  2.2UF  MATERIAL: X5R  PACK_TYPE: 0402  TOLERANCE: 10%  VOLTAGE: 10V  [SMC0402IA]
C7R2  1uF  MATERIAL: EMPTY  PACK_TYPE: 0402  TOLERANCE: 10%  VOLTAGE: 6.3V  [SMC0402IA]
C7R3  1uF  MATERIAL: EMPTY  PACK_TYPE: 0402  TOLERANCE: 10%  VOLTAGE: 6.3V  [SMC0402IA]
C7R4  1uF  MATERIAL: EMPTY  PACK_TYPE: 0402  TOLERANCE: 10%  VOLTAGE: 6.3V  [SMC0402IA]
C7R5  1uF  MATERIAL: EMPTY  PACK_TYPE: 0402  TOLERANCE: 10%  VOLTAGE: 6.3V  [SMC0402IA]
C7R6  1uF  MATERIAL: EMPTY  PACK_TYPE: 0402  TOLERANCE: 10%  VOLTAGE: 6.3V  [SMC0402IA]
C7R7  1uF  MATERIAL: EMPTY  PACK_TYPE: 0402  TOLERANCE: 10%  VOLTAGE: 6.3V  [SMC0402IA]
C7R8  1uF  MATERIAL: EMPTY  PACK_TYPE: 0402  TOLERANCE: 10%  VOLTAGE: 6.3V  [SMC0402IA]
C7R9  1uF  MATERIAL: EMPTY  PACK_TYPE: 0402  TOLERANCE: 10%  VOLTAGE: 6.3V  [SMC0402IA]
C7R10  1uF  MATERIAL: EMPTY  PACK_TYPE: 0402  TOLERANCE: 10%  VOLTAGE: 6.3V  [SMC0402IA]
C7R11  1uF  MATERIAL: EMPTY  PACK_TYPE: 0402  TOLERANCE: 10%  VOLTAGE: 6.3V  [SMC0402IA]
C7R12  1uF  MATERIAL: EMPTY  PACK_TYPE: 0402  TOLERANCE: 10%  VOLTAGE: 6.3V  [SMC0402IA]
C7R13  1uF  MATERIAL: EMPTY  PACK_TYPE: 0402  TOLERANCE: 10%  VOLTAGE: 6.3V  [SMC0402IA]
C7R14  1uF  MATERIAL: EMPTY  PACK_TYPE: 0402  TOLERANCE: 10%  VOLTAGE: 6.3V  [SMC0402IA]
C7R15  1uF  MATERIAL: EMPTY  PACK_TYPE: 0402  TOLERANCE: 10%  VOLTAGE: 6.3V  [SMC0402IA]
C7R18  1uF  MATERIAL: X5R  PACK_TYPE: 0402  TOLERANCE: 10%  VOLTAGE: 6.3V  [SMC0402IA]
C7R19  0.1uF  MATERIAL: X7R  PACK_TYPE: 0402  PART_NUMBER: A36096-112  TOLERANCE: 10%  VOLTAGE: 25V  [SMC0402IA]

### Nets
+VCC_MPHYPLL_1P8: C7R9.1(A)
+VCCA_0P82: C6R3.1(A) C6R7.1(A)
+VCCA_XTAL_PLL_1P8: C7P7.1(A) C7R5.1(A) C7R7.1(A)
+VCCCNVI_LDO_0P4: C7E1.1(A)
+VCCDPHY_1P24: C7R1.1(A)
+VCCHSIO_0P82: C6F1.1(A) C6F2.1(A) C6F3.1(A) C7R10.1(A)
+VCCPDSW_3P3: C7F1.1(A)
+VCCPRIM_1P05: C7R2.1(A)
+VCCPRIM_1P8: C7R3.1(A) C7R4.1(A) C7R6.1(A) C7R8.1(A) C7R11.1(A)
+VCCPRIM_3P3: C7R12.1(A) C7R13.1(A) C7R14.1(A) C7R15.1(A)
+VCCPRIMCORE_0P82: C6R11.1(A) C7P8.1(A)
+VCCPRTC_3P3: C7R18.1(A) C7R19.1(A)
+VCCRTCEXT: C7F2.1(A)
GND: C6F1.2(B) C6F2.2(B) C6F3.2(B) C6R3.2(B) C6R7.2(B) C6R11.2(B) C7E1.2(B) C7F1.2(B) C7F2.2(B) C7P7.2(B) C7P8.2(B) C7R1.2(B) C7R2.2(B) C7R3.2(B) C7R4.2(B) C7R5.2(B) C7R6.2(B) C7R7.2(B) C7R8.2(B) C7R9.2(B) C7R10.2(B) C7R11.2(B) C7R12.2(B) C7R13.2(B) C7R14.2(B) C7R15.2(B) C7R18.2(B) C7R19.2(B)  [project net EXP_A_RX_4_DP]

### Notes on the sheet
- CAD NOTE:
- TO PACKAGE EDGE
- PLACE EDGE CAPS WITHIN 5MM
- PLACE EDGE CAPS WITHIN 10MM

### Library data of the parts
C6F1 = CAP: PART_NUMBER: A36096-121; CDS_PHYS_PART_NAME: CAP_0402-A36096-121,X5R,2.2UF,10V,10%,LPDB,GENERIC; OriginalSymbolOrigin: (-50,25); XY: (-12700,3475); VER: 1; ROT: 0; PHYS_PAGE: 42; LOCATION: C6F1; IP: GENERIC; FP_TECH: LPDB; DRAWING: @RVP1_ADL_SB_ADP_S_DDR5_SODIMM_2DPC_LIB.H55_DG2_2DPC(SCH_1):PAGE42; CDS_LIB: discrete; PCB Footprint: SMC0402IA; SEC_TYPE: 0402; CHIPS_PART_NAME: CAP; CDS_PART_NAME: CAP_0402-A36096-121,X5R,2.2UF,10V,10%,LPDB,GENERIC; CDS_LOCATION: C6F1; ASI_MODEL: A36096-121
C6F2 = CAP: PART_NUMBER: A36096-121; CDS_PHYS_PART_NAME: CAP_0402-A36096-121,X5R,2.2UF,10V,10%,LPDB,GENERIC; OriginalSymbolOrigin: (-50,25); XY: (-12125,3475); VER: 1; ROT: 0; PHYS_PAGE: 42; LOCATION: C6F2; IP: GENERIC; FP_TECH: LPDB; DRAWING: @RVP1_ADL_SB_ADP_S_DDR5_SODIMM_2DPC_LIB.H55_DG2_2DPC(SCH_1):PAGE42; CDS_LIB: discrete; PCB Footprint: SMC0402IA; SEC_TYPE: 0402; CHIPS_PART_NAME: CAP; CDS_PART_NAME: CAP_0402-A36096-121,X5R,2.2UF,10V,10%,LPDB,GENERIC; CDS_LOCATION: C6F2; ASI_MODEL: A36096-121
C6F3 = CAP: PART_NUMBER: 602433-081; CDS_PHYS_PART_NAME: CAP_0603-602433-081,X5R,22UF,6.3V,20%,LPDB,GENERIC; OriginalSymbolOrigin: (-50,25); XY: (-15600,1300); VER: 1; ROT: 0; PHYS_PAGE: 42; LOCATION: C6F3; IP: GENERIC; FP_TECH: LPDB; FIN: VREG_CPU_DCPL; DRAWING: @RVP1_ADL_SB_ADP_S_DDR5_SODIMM_2DPC_LIB.H55_DG2_2DPC(SCH_1):PAGE42; CDS_LIB: discrete; BOM: CORE_VREG_CPU; PCB Footprint: SMC0603ID; SEC_TYPE: 0603; CHIPS_PART_NAME: CAP; CDS_PART_NAME: CAP_0603-602433-081,X5R,22UF,6.3V,20%,LPDB,GENERIC; CDS_LOCATION: C6F3; ASI_MODEL: 602433-081
C6R3 = CAP: PART_NUMBER: A36096-027; CDS_PHYS_PART_NAME: CAP_0402-A36096-027,EMPTY,1UF,6.3V,10%,LPDB,GENERIC; OriginalSymbolOrigin: (-50,25); XY: (-14950,4100); VER: 1; ROT: 0; PHYS_PAGE: 42; LOCATION: C6R3; IP: GENERIC; FP_TECH: LPDB; DRAWING: @RVP1_ADL_SB_ADP_S_DDR5_SODIMM_2DPC_LIB.H55_DG2_2DPC(SCH_1):PAGE42; CDS_LIB: discrete; PCB Footprint: SMC0402IA; SEC_TYPE: 0402; CHIPS_PART_NAME: CAP; CDS_PART_NAME: CAP_0402-A36096-027,EMPTY,1UF,6.3V,10%,LPDB,GENERIC; CDS_LOCATION: C6R3; ASI_MODEL: A36096-027
C6R7 = CAP: PART_NUMBER: A36096-027; CDS_PHYS_PART_NAME: CAP_0402-A36096-027,EMPTY,1UF,6.3V,10%,LPDB,GENERIC; OriginalSymbolOrigin: (-50,25); XY: (-12450,4100); VER: 1; ROT: 0; PHYS_PAGE: 42; LOCATION: C6R7; IP: GENERIC; FP_TECH: LPDB; DRAWING: @RVP1_ADL_SB_ADP_S_DDR5_SODIMM_2DPC_LIB.H55_DG2_2DPC(SCH_1):PAGE42; CDS_LIB: discrete; PCB Footprint: SMC0402IA; SEC_TYPE: 0402; CHIPS_PART_NAME: CAP; CDS_PART_NAME: CAP_0402-A36096-027,EMPTY,1UF,6.3V,10%,LPDB,GENERIC; CDS_LOCATION: C6R7; ASI_MODEL: A36096-027
C6R11 = CAP: PART_NUMBER: 602433-081; CDS_PHYS_PART_NAME: CAP_0603-602433-081,EMPTY,22UF,6.3V,20%,LPDB,GENERIC; OriginalSymbolOrigin: (-50,25); XY: (-13200,1300); VER: 1; ROT: 0; PHYS_PAGE: 42; LOCATION: C6R11; IP: GENERIC; FP_TECH: LPDB; FIN: VREG_CPU_DCPL; DRAWING: @RVP1_ADL_SB_ADP_S_DDR5_SODIMM_2DPC_LIB.H55_DG2_2DPC(SCH_1):PAGE42; CDS_LIB: discrete; BOM: CORE_VREG_CPU; PCB Footprint: SMC0603ID; SEC_TYPE: 0603; CHIPS_PART_NAME: CAP; CDS_PART_NAME: CAP_0603-602433-081,EMPTY,22UF,6.3V,20%,LPDB,GENERIC; CDS_LOCATION: C6R11; ASI_MODEL: 602433-081
C7E1 = CAP: PART_NUMBER: A36096-157; CDS_PHYS_PART_NAME: CAP_0402-A36096-157,X7R,2.2NF,16V,10%,LPDB,GENERIC; OriginalSymbolOrigin: (-50,25); XY: (-9800,3450); VER: 1; ROT: 0; PHYS_PAGE: 42; LOCATION: C7E1; IP: GENERIC; FP_TECH: LPDB; DRAWING: @RVP1_ADL_SB_ADP_S_DDR5_SODIMM_2DPC_LIB.H55_DG2_2DPC(SCH_1):PAGE42; CDS_LIB: discrete; PCB Footprint: SMC0402IA; SEC_TYPE: 0402; CHIPS_PART_NAME: CAP; CDS_PART_NAME: CAP_0402-A36096-157,X7R,2.2NF,16V,10%,LPDB,GENERIC; CDS_LOCATION: C7E1; ASI_MODEL: A36096-157
C7F1 = CAP: PART_NUMBER: A36096-027; CDS_PHYS_PART_NAME: CAP_0402-A36096-027,EMPTY,1UF,6.3V,10%,LPDB,GENERIC; OriginalSymbolOrigin: (-50,25); XY: (-15000,1325); VER: 1; ROT: 0; PHYS_PAGE: 42; LOCATION: C7F1; IP: GENERIC; FP_TECH: LPDB; DRAWING: @RVP1_ADL_SB_ADP_S_DDR5_SODIMM_2DPC_LIB.H55_DG2_2DPC(SCH_1):PAGE42; CDS_LIB: discrete; PCB Footprint: SMC0402IA; SEC_TYPE: 0402; CHIPS_PART_NAME: CAP; CDS_PART_NAME: CAP_0402-A36096-027,EMPTY,1UF,6.3V,10%,LPDB,GENERIC; CDS_LOCATION: C7F1; ASI_MODEL: A36096-027
C7F2 = CAP: PART_NUMBER: A36096-009; CDS_PHYS_PART_NAME: CAP_0402-A36096-009,X5R,0.1UF,10V,10%,LPDB,GENERIC; OriginalSymbolOrigin: (-50,25); XY: (-9225,3450); VER: 1; ROT: 0; PHYS_PAGE: 42; LOCATION: C7F2; IP: GENERIC; FP_TECH: LPDB; DRAWING: @RVP1_ADL_SB_ADP_S_DDR5_SODIMM_2DPC_LIB.H55_DG2_2DPC(SCH_1):PAGE42; CDS_LIB: discrete; PCB Footprint: SMC0402IA; SEC_TYPE: 0402; CHIPS_PART_NAME: CAP; CDS_PART_NAME: CAP_0402-A36096-009,X5R,0.1UF,10V,10%,LPDB,GENERIC; CDS_LOCATION: C7F2; ASI_MODEL: A36096-009
C7P7 = CAP: PART_NUMBER: A36096-027; CDS_PHYS_PART_NAME: CAP_0402-A36096-027,EMPTY,1UF,6.3V,10%,LPDB,GENERIC; OriginalSymbolOrigin: (-50,25); XY: (-15175,3475); VER: 1; ROT: 0; PHYS_PAGE: 42; LOCATION: C7P7; IP: GENERIC; FP_TECH: LPDB; DRAWING: @RVP1_ADL_SB_ADP_S_DDR5_SODIMM_2DPC_LIB.H55_DG2_2DPC(SCH_1):PAGE42; CDS_LIB: discrete; PCB Footprint: SMC0402IA; SEC_TYPE: 0402; CHIPS_PART_NAME: CAP; CDS_PART_NAME: CAP_0402-A36096-027,EMPTY,1UF,6.3V,10%,LPDB,GENERIC; CDS_LOCATION: C7P7; ASI_MODEL: A36096-027
C7P8 = CAP: PART_NUMBER: A36096-027; CDS_PHYS_PART_NAME: CAP_0402-A36096-027,EMPTY,1UF,6.3V,10%,LPDB,GENERIC; OriginalSymbolOrigin: (-50,25); XY: (-14450,1325); VER: 1; ROT: 0; PHYS_PAGE: 42; LOCATION: C7P8; IP: GENERIC; FP_TECH: LPDB; DRAWING: @RVP1_ADL_SB_ADP_S_DDR5_SODIMM_2DPC_LIB.H55_DG2_2DPC(SCH_1):PAGE42; CDS_LIB: discrete; PCB Footprint: SMC0402IA; SEC_TYPE: 0402; CHIPS_PART_NAME: CAP; CDS_PART_NAME: CAP_0402-A36096-027,EMPTY,1UF,6.3V,10%,LPDB,GENERIC; CDS_LOCATION: C7P8; ASI_MODEL: A36096-027
C7R1 = CAP: PART_NUMBER: A36096-121; CDS_PHYS_PART_NAME: CAP_0402-A36096-121,X5R,2.2UF,10V,10%,LPDB,GENERIC; OriginalSymbolOrigin: (-50,25); XY: (-10400,3450); VER: 1; ROT: 0; PHYS_PAGE: 42; LOCATION: C7R1; IP: GENERIC; FP_TECH: LPDB; DRAWING: @RVP1_ADL_SB_ADP_S_DDR5_SODIMM_2DPC_LIB.H55_DG2_2DPC(SCH_1):PAGE42; CDS_LIB: discrete; PCB Footprint: SMC0402IA; SEC_TYPE: 0402; CHIPS_PART_NAME: CAP; CDS_PART_NAME: CAP_0402-A36096-121,X5R,2.2UF,10V,10%,LPDB,GENERIC; CDS_LOCATION: C7R1; ASI_MODEL: A36096-121
C7R2 = CAP: PART_NUMBER: A36096-027; CDS_PHYS_PART_NAME: CAP_0402-A36096-027,EMPTY,1UF,6.3V,10%,LPDB,GENERIC; OriginalSymbolOrigin: (-50,25); XY: (-10975,3450); VER: 1; ROT: 0; PHYS_PAGE: 42; LOCATION: C7R2; IP: GENERIC; FP_TECH: LPDB; DRAWING: @RVP1_ADL_SB_ADP_S_DDR5_SODIMM_2DPC_LIB.H55_DG2_2DPC(SCH_1):PAGE42; CDS_LIB: discrete; PCB Footprint: SMC0402IA; CHIPS_PART_NAME: CAP; CDS_PART_NAME: CAP_0402-A36096-027,EMPTY,1UF,6.3V,10%,LPDB,GENERIC; CDS_LOCATION: C7R2; ASI_MODEL: A36096-027
C7R3 = CAP: PART_NUMBER: A36096-027; CDS_PHYS_PART_NAME: CAP_0402-A36096-027,EMPTY,1UF,6.3V,10%,LPDB,GENERIC; OriginalSymbolOrigin: (-50,25); XY: (-13825,1325); VER: 1; ROT: 0; PHYS_PAGE: 42; LOCATION: C7R3; IP: GENERIC; FP_TECH: LPDB; DRAWING: @RVP1_ADL_SB_ADP_S_DDR5_SODIMM_2DPC_LIB.H55_DG2_2DPC(SCH_1):PAGE42; CDS_LIB: discrete; PCB Footprint: SMC0402IA; SEC_TYPE: 0402; CHIPS_PART_NAME: CAP; CDS_PART_NAME: CAP_0402-A36096-027,EMPTY,1UF,6.3V,10%,LPDB,GENERIC; CDS_LOCATION: C7R3; ASI_MODEL: A36096-027
C7R4 = CAP: PART_NUMBER: A36096-027; CDS_PHYS_PART_NAME: CAP_0402-A36096-027,EMPTY,1UF,6.3V,10%,LPDB,GENERIC; OriginalSymbolOrigin: (-50,25); XY: (-13525,2150); VER: 1; ROT: 0; PHYS_PAGE: 42; LOCATION: C7R4; IP: GENERIC; FP_TECH: LPDB; DRAWING: @RVP1_ADL_SB_ADP_S_DDR5_SODIMM_2DPC_LIB.H55_DG2_2DPC(SCH_1):PAGE42; CDS_LIB: discrete; PCB Footprint: SMC0402IA; SEC_TYPE: 0402; CHIPS_PART_NAME: CAP; CDS_PART_NAME: CAP_0402-A36096-027,EMPTY,1UF,6.3V,10%,LPDB,GENERIC; CDS_LOCATION: C7R4; ASI_MODEL: A36096-027
C7R5 = CAP: PART_NUMBER: A36096-027; CDS_PHYS_PART_NAME: CAP_0402-A36096-027,EMPTY,1UF,6.3V,10%,LPDB,GENERIC; OriginalSymbolOrigin: (-50,25); XY: (-13175,4100); VER: 1; ROT: 0; PHYS_PAGE: 42; LOCATION: C7R5; IP: GENERIC; FP_TECH: LPDB; DRAWING: @RVP1_ADL_SB_ADP_S_DDR5_SODIMM_2DPC_LIB.H55_DG2_2DPC(SCH_1):PAGE42; CDS_LIB: discrete; PCB Footprint: SMC0402IA; SEC_TYPE: 0402; CHIPS_PART_NAME: CAP; CDS_PART_NAME: CAP_0402-A36096-027,EMPTY,1UF,6.3V,10%,LPDB,GENERIC; CDS_LOCATION: C7R5; ASI_MODEL: A36096-027
C7R6 = CAP: PART_NUMBER: A36096-027; CDS_PHYS_PART_NAME: CAP_0402-A36096-027,EMPTY,1UF,6.3V,10%,LPDB,GENERIC; OriginalSymbolOrigin: (-50,25); XY: (-13850,3475); VER: 1; ROT: 0; PHYS_PAGE: 42; LOCATION: C7R6; IP: GENERIC; FP_TECH: LPDB; DRAWING: @RVP1_ADL_SB_ADP_S_DDR5_SODIMM_2DPC_LIB.H55_DG2_2DPC(SCH_1):PAGE42; CDS_LIB: discrete; PCB Footprint: SMC0402IA; SEC_TYPE: 0402; CHIPS_PART_NAME: CAP; CDS_PART_NAME: CAP_0402-A36096-027,EMPTY,1UF,6.3V,10%,LPDB,GENERIC; CDS_LOCATION: C7R6; ASI_MODEL: A36096-027
C7R7 = CAP: PART_NUMBER: A36096-027; CDS_PHYS_PART_NAME: CAP_0402-A36096-027,EMPTY,1UF,6.3V,10%,LPDB,GENERIC; OriginalSymbolOrigin: (-50,25); XY: (-10275,4100); VER: 1; ROT: 0; PHYS_PAGE: 42; LOCATION: C7R7; IP: GENERIC; FP_TECH: LPDB; DRAWING: @RVP1_ADL_SB_ADP_S_DDR5_SODIMM_2DPC_LIB.H55_DG2_2DPC(SCH_1):PAGE42; CDS_LIB: discrete; PCB Footprint: SMC0402IA; SEC_TYPE: 0402; CHIPS_PART_NAME: CAP; CDS_PART_NAME: CAP_0402-A36096-027,EMPTY,1UF,6.3V,10%,LPDB,GENERIC; CDS_LOCATION: C7R7; ASI_MODEL: A36096-027
C7R8 = CAP: PART_NUMBER: A36096-027; CDS_PHYS_PART_NAME: CAP_0402-A36096-027,EMPTY,1UF,6.3V,10%,LPDB,GENERIC; OriginalSymbolOrigin: (-50,25); XY: (-14525,3475); VER: 1; ROT: 0; PHYS_PAGE: 42; LOCATION: C7R8; IP: GENERIC; FP_TECH: LPDB; DRAWING: @RVP1_ADL_SB_ADP_S_DDR5_SODIMM_2DPC_LIB.H55_DG2_2DPC(SCH_1):PAGE42; CDS_LIB: discrete; PCB Footprint: SMC0402IA; CHIPS_PART_NAME: CAP; CDS_PART_NAME: CAP_0402-A36096-027,EMPTY,1UF,6.3V,10%,LPDB,GENERIC; CDS_LOCATION: C7R8; ASI_MODEL: A36096-027
C7R9 = CAP: PART_NUMBER: A36096-027; CDS_PHYS_PART_NAME: CAP_0402-A36096-027,EMPTY,1UF,6.3V,10%,LPDB,GENERIC; OriginalSymbolOrigin: (-50,25); XY: (-10875,4100); VER: 1; ROT: 0; PHYS_PAGE: 42; LOCATION: C7R9; IP: GENERIC; FP_TECH: LPDB; DRAWING: @RVP1_ADL_SB_ADP_S_DDR5_SODIMM_2DPC_LIB.H55_DG2_2DPC(SCH_1):PAGE42; CDS_LIB: discrete; PCB Footprint: SMC0402IA; SEC_TYPE: 0402; CHIPS_PART_NAME: CAP; CDS_PART_NAME: CAP_0402-A36096-027,EMPTY,1UF,6.3V,10%,LPDB,GENERIC; CDS_LOCATION: C7R9; ASI_MODEL: A36096-027
C7R10 = CAP: PART_NUMBER: A36096-027; CDS_PHYS_PART_NAME: CAP_0402-A36096-027,EMPTY,1UF,6.3V,10%,LPDB,GENERIC; OriginalSymbolOrigin: (-50,25); XY: (-11550,3475); VER: 1; ROT: 0; PHYS_PAGE: 42; LOCATION: C7R10; IP: GENERIC; FP_TECH: LPDB; DRAWING: @RVP1_ADL_SB_ADP_S_DDR5_SODIMM_2DPC_LIB.H55_DG2_2DPC(SCH_1):PAGE42; CDS_LIB: discrete; PCB Footprint: SMC0402IA; CHIPS_PART_NAME: CAP; CDS_PART_NAME: CAP_0402-A36096-027,EMPTY,1UF,6.3V,10%,LPDB,GENERIC; CDS_LOCATION: C7R10; ASI_MODEL: A36096-027
C7R11 = CAP: PART_NUMBER: A36096-027; CDS_PHYS_PART_NAME: CAP_0402-A36096-027,EMPTY,1UF,6.3V,10%,LPDB,GENERIC; OriginalSymbolOrigin: (-50,25); XY: (-15625,2150); VER: 1; ROT: 0; PHYS_PAGE: 42; LOCATION: C7R11; IP: GENERIC; FP_TECH: LPDB; DRAWING: @RVP1_ADL_SB_ADP_S_DDR5_SODIMM_2DPC_LIB.H55_DG2_2DPC(SCH_1):PAGE42; CDS_LIB: discrete; PCB Footprint: SMC0402IA; SEC_TYPE: 0402; CHIPS_PART_NAME: CAP; CDS_PART_NAME: CAP_0402-A36096-027,EMPTY,1UF,6.3V,10%,LPDB,GENERIC; CDS_LOCATION: C7R11; ASI_MODEL: A36096-027
C7R12 = CAP: PART_NUMBER: A36096-027; CDS_PHYS_PART_NAME: CAP_0402-A36096-027,EMPTY,1UF,6.3V,10%,LPDB,GENERIC; OriginalSymbolOrigin: (-50,25); XY: (-12775,2150); VER: 1; ROT: 0; PHYS_PAGE: 42; LOCATION: C7R12; IP: GENERIC; FP_TECH: LPDB; DRAWING: @RVP1_ADL_SB_ADP_S_DDR5_SODIMM_2DPC_LIB.H55_DG2_2DPC(SCH_1):PAGE42; CDS_LIB: discrete; PCB Footprint: SMC0402IA; SEC_TYPE: 0402; CHIPS_PART_NAME: CAP; CDS_PART_NAME: CAP_0402-A36096-027,EMPTY,1UF,6.3V,10%,LPDB,GENERIC; CDS_LOCATION: C7R12; ASI_MODEL: A36096-027
C7R13 = CAP: PART_NUMBER: A36096-027; CDS_PHYS_PART_NAME: CAP_0402-A36096-027,EMPTY,1UF,6.3V,10%,LPDB,GENERIC; OriginalSymbolOrigin: (-50,25); XY: (-14250,2150); VER: 1; ROT: 0; PHYS_PAGE: 42; LOCATION: C7R13; IP: GENERIC; FP_TECH: LPDB; DRAWING: @RVP1_ADL_SB_ADP_S_DDR5_SODIMM_2DPC_LIB.H55_DG2_2DPC(SCH_1):PAGE42; CDS_LIB: discrete; PCB Footprint: SMC0402IA; SEC_TYPE: 0402; CHIPS_PART_NAME: CAP; CDS_PART_NAME: CAP_0402-A36096-027,EMPTY,1UF,6.3V,10%,LPDB,GENERIC; CDS_LOCATION: C7R13; ASI_MODEL: A36096-027
C7R14 = CAP: PART_NUMBER: A36096-027; CDS_PHYS_PART_NAME: CAP_0402-A36096-027,EMPTY,1UF,6.3V,10%,LPDB,GENERIC; OriginalSymbolOrigin: (-50,25); XY: (-14950,2150); VER: 1; ROT: 0; PHYS_PAGE: 42; LOCATION: C7R14; IP: GENERIC; FP_TECH: LPDB; DRAWING: @RVP1_ADL_SB_ADP_S_DDR5_SODIMM_2DPC_LIB.H55_DG2_2DPC(SCH_1):PAGE42; CDS_LIB: discrete; PCB Footprint: SMC0402IA; SEC_TYPE: 0402; CHIPS_PART_NAME: CAP; CDS_PART_NAME: CAP_0402-A36096-027,EMPTY,1UF,6.3V,10%,LPDB,GENERIC; CDS_LOCATION: C7R14; ASI_MODEL: A36096-027
C7R15 = CAP: PART_NUMBER: A36096-027; CDS_PHYS_PART_NAME: CAP_0402-A36096-027,EMPTY,1UF,6.3V,10%,LPDB,GENERIC; OriginalSymbolOrigin: (-50,25); XY: (-13225,3475); VER: 1; ROT: 0; PHYS_PAGE: 42; LOCATION: C7R15; IP: GENERIC; FP_TECH: LPDB; DRAWING: @RVP1_ADL_SB_ADP_S_DDR5_SODIMM_2DPC_LIB.H55_DG2_2DPC(SCH_1):PAGE42; CDS_LIB: discrete; PCB Footprint: SMC0402IA; CHIPS_PART_NAME: CAP; CDS_PART_NAME: CAP_0402-A36096-027,EMPTY,1UF,6.3V,10%,LPDB,GENERIC; CDS_LOCATION: C7R15; ASI_MODEL: A36096-027
C7R18 = CAP: PART_NUMBER: A36096-027; CDS_PHYS_PART_NAME: CAP_0402-A36096-027,X5R,1UF,6.3V,10%,LPDB,GENERIC; OriginalSymbolOrigin: (-50,25); XY: (-12650,1300); VER: 1; ROT: 0; PHYS_PAGE: 42; LOCATION: C7R18; IP: GENERIC; FP_TECH: LPDB; FIN: GLUE; DRAWING: @RVP1_ADL_SB_ADP_S_DDR5_SODIMM_2DPC_LIB.H55_DG2_2DPC(SCH_1):PAGE42; CDS_LIB: discrete; PCB Footprint: SMC0402IA; CHIPS_PART_NAME: CAP; CDS_PART_NAME: CAP_0402-A36096-027,X5R,1UF,6.3V,10%,LPDB,GENERIC; CDS_LOCATION: C7R18; ASI_MODEL: A36096-027
C7R19 = CAP: CDS_PHYS_PART_NAME: CAP_0402-A36096-112,X7R,0.1UF,25V,10%,LPDB,GENERIC; OriginalSymbolOrigin: (-50,25); XY: (-12125,1300); VER: 1; ROT: 0; PHYS_PAGE: 42; LOCATION: C7R19; IP: GENERIC; FP_TECH: LPDB; FIN: VREG_V_CPU_CORE; DRAWING: @RVP1_ADL_SB_ADP_S_DDR5_SODIMM_2DPC_LIB.H55_DG2_2DPC(SCH_1):PAGE42; CDS_LIB: discrete; PCB Footprint: SMC0402IA; CHIPS_PART_NAME: CAP; CDS_PART_NAME: CAP_0402-A36096-112,X7R,0.1UF,25V,10%,LPDB,GENERIC; CDS_LOCATION: C7R19; ASI_MODEL: A36096-112

## Sheet 0043_GPP_MUX_E.SchDoc
size A3
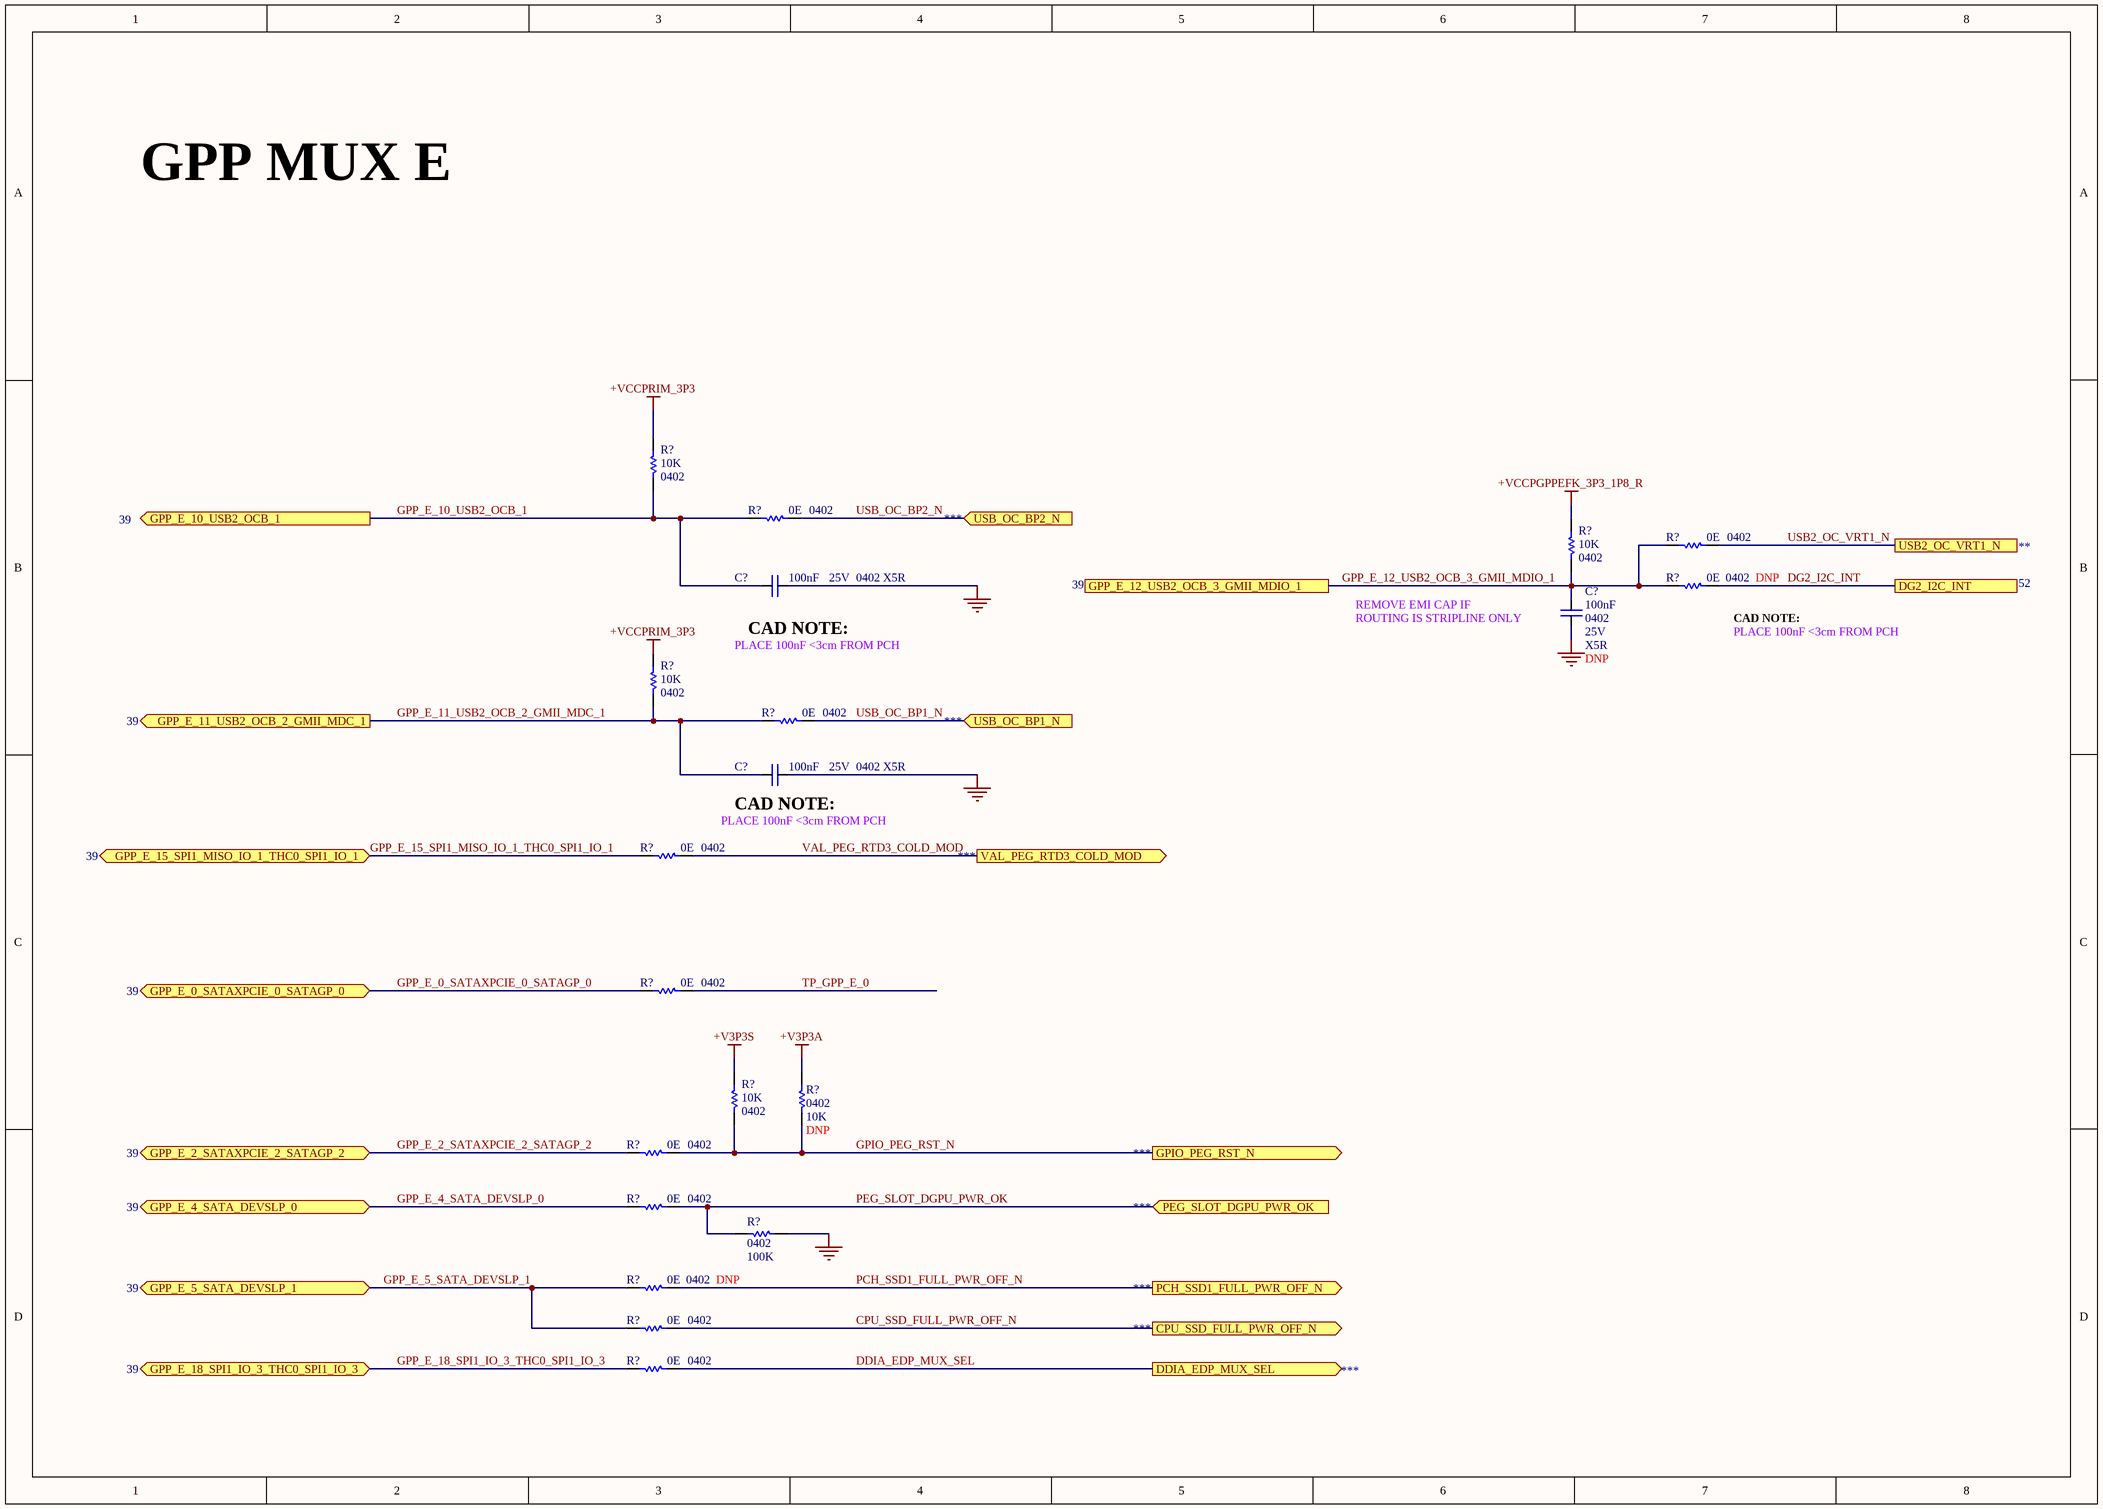
[diagram p73: 0043_GPP_MUX_E.SchDoc]

### Parts
(Parts that share a designator on the sheet are numbered #1, #2 ... from top to bottom, then left to right.)
C?#98  value 100nF  Case/Package: 0402  Voltage: 25V  Dielectric: X5R  [CAPC0402]
C?#99  value 100nF  Case/Package: 0402  Voltage: 25V  Dielectric: X5R  [CAPC0402]
C?#100  value 100nF  Case/Package: 0402  Voltage: 25V  Dielectric: X5R  [CAPC0402]
R?#157  value 10K  Case/Package: 0402  [RESC0402]  (hidden comment: Res)
R?#158  value 0E  Case/Package: 0402  [RESC0402]  (hidden comment: Res)
R?#159  value 10K  Case/Package: 0402  [RESC0402]  (hidden comment: Res)
R?#160  value 0E  Case/Package: 0402  [RESC0402]  (hidden comment: Res)
R?#161  value 0E  Case/Package: 0402  [RESC0402]  (hidden comment: Res)
R?#162  value 10K  Case/Package: 0402  [RESC0402]  (hidden comment: Res)
R?#163  value 0E  Case/Package: 0402  [RESC0402]  (hidden comment: Res)
R?#164  value 0E  Case/Package: 0402  [RESC0402]  (hidden comment: Res)
R?#165  value 0E  Case/Package: 0402  [RESC0402]  (hidden comment: Res)
R?#166  value 10K  Case/Package: 0402  [RESC0402]  (hidden comment: Res)
R?#167  value 10K  Case/Package: 0402  [RESC0402]  (hidden comment: Res)
R?#168  value 0E  Case/Package: 0402  [RESC0402]  (hidden comment: Res)
R?#169  value 0E  Case/Package: 0402  [RESC0402]  (hidden comment: Res)
R?#170  value 100K  Case/Package: 0402  [RESC0402]  (hidden comment: Res)
R?#171  value 0E  Case/Package: 0402  [RESC0402]  (hidden comment: Res)
R?#172  value 0E  Case/Package: 0402  [RESC0402]  (hidden comment: Res)
R?#173  value 0E  Case/Package: 0402  [RESC0402]  (hidden comment: Res)

### Ports
CPU_SSD_FULL_PWR_OFF_N (out), DDIA_EDP_MUX_SEL (out), DG2_I2C_INT, GPIO_PEG_RST_N (out), GPP_E_0_SATAXPCIE_0_SATAGP_0 (bidir), GPP_E_2_SATAXPCIE_2_SATAGP_2 (bidir), GPP_E_4_SATA_DEVSLP_0 (bidir), GPP_E_5_SATA_DEVSLP_1 (bidir), GPP_E_10_USB2_OCB_1 (out), GPP_E_11_USB2_OCB_2_GMII_MDC_1 (out), GPP_E_12_USB2_OCB_3_GMII_MDIO_1, GPP_E_15_SPI1_MISO_IO_1_THC0_SPI1_IO_1 (bidir), GPP_E_18_SPI1_IO_3_THC0_SPI1_IO_3 (bidir), PCH_SSD1_FULL_PWR_OFF_N (out), PEG_SLOT_DGPU_PWR_OK (in), USB2_OC_VRT1_N, USB_OC_BP1_N (in), USB_OC_BP2_N (in), VAL_PEG_RTD3_COLD_MOD (out)

### Nets
+V3P3A: R?#167.2
+V3P3S: R?#166.2
+VCCPGPPEFK_3P3_1P8_R: R?#159.2
+VCCPRIM_3P3: R?#157.2 R?#162.2
GND: C?#98.2 C?#99.1 C?#100.2 R?#170.1  [project net EXP_A_RX_4_DP]
CPU_SSD_FULL_PWR_OFF_N: R?#172.2 ; port CPU_SSD_FULL_PWR_OFF_N
DDIA_EDP_MUX_SEL: R?#173.2 ; port DDIA_EDP_MUX_SEL
DG2_I2C_INT: R?#161.2 ; port DG2_I2C_INT
GPIO_PEG_RST_N: R?#166.1 R?#167.1 R?#168.2 ; port GPIO_PEG_RST_N
GPP_E_0_SATAXPCIE_0_SATAGP_0: R?#165.1 ; port GPP_E_0_SATAXPCIE_0_SATAGP_0
GPP_E_2_SATAXPCIE_2_SATAGP_2: R?#168.1 ; port GPP_E_2_SATAXPCIE_2_SATAGP_2
GPP_E_4_SATA_DEVSLP_0: R?#169.1 ; port GPP_E_4_SATA_DEVSLP_0
GPP_E_5_SATA_DEVSLP_1: R?#171.1 R?#172.1 ; port GPP_E_5_SATA_DEVSLP_1
GPP_E_10_USB2_OCB_1: C?#98.1 R?#157.1 R?#158.1 ; port GPP_E_10_USB2_OCB_1
GPP_E_11_USB2_OCB_2_GMII_MDC_1: C?#100.1 R?#162.1 R?#163.1 ; port GPP_E_11_USB2_OCB_2_GMII_MDC_1
GPP_E_12_USB2_OCB_3_GMII_MDIO_1: C?#99.2 R?#159.1 R?#160.1 R?#161.1 ; port GPP_E_12_USB2_OCB_3_GMII_MDIO_1
GPP_E_15_SPI1_MISO_IO_1_THC0_SPI1_IO_1: R?#164.1 ; port GPP_E_15_SPI1_MISO_IO_1_THC0_SPI1_IO_1
GPP_E_18_SPI1_IO_3_THC0_SPI1_IO_3: R?#173.1 ; port GPP_E_18_SPI1_IO_3_THC0_SPI1_IO_3
PCH_SSD1_FULL_PWR_OFF_N: R?#171.2 ; port PCH_SSD1_FULL_PWR_OFF_N
PEG_SLOT_DGPU_PWR_OK: R?#169.2 R?#170.2 ; port PEG_SLOT_DGPU_PWR_OK
TP_GPP_E_0: R?#165.2
USB2_OC_VRT1_N: R?#160.2 ; port USB2_OC_VRT1_N
USB_OC_BP1_N: R?#163.2 ; port USB_OC_BP1_N
USB_OC_BP2_N: R?#158.2 ; port USB_OC_BP2_N
VAL_PEG_RTD3_COLD_MOD: R?#164.2 ; port VAL_PEG_RTD3_COLD_MOD

### Notes on the sheet
- GPP MUX E
- PLACE 100nF <3cm FROM PCH
- (near C?#98) CAD NOTE:
- REMOVE EMI CAP IF
- ROUTING IS STRIPLINE ONLY
- (near R?#161) CAD NOTE:
- (near R?#161) PLACE 100nF <3cm FROM PCH
- (near C?#100) CAD NOTE:

### Library data of the parts
C?#98-C?#100 = Cap: CAP CER 100nF 25V X5R 0402
  C?#99: DNP: DNP
R?#157 R?#159 R?#162 R?#166 R?#167 = Res: Thick Film Resistor -  10Kohm, 1%, 0402
  R?#167: DNP: DNP
R?#158 R?#160 R?#161 R?#163-R?#165 R?#168 R?#169 R?#171-R?#173 = Res: Thick Film Resistor -  0ohm, 1%, 0402
  R?#161 R?#171: DNP: DNP
R?#170 = Res: Thick Film Resistor -  100Kohm, 1%, 0402

## Sheet 0044_RPL PCH H GPIO OPT.SchDoc
size A2
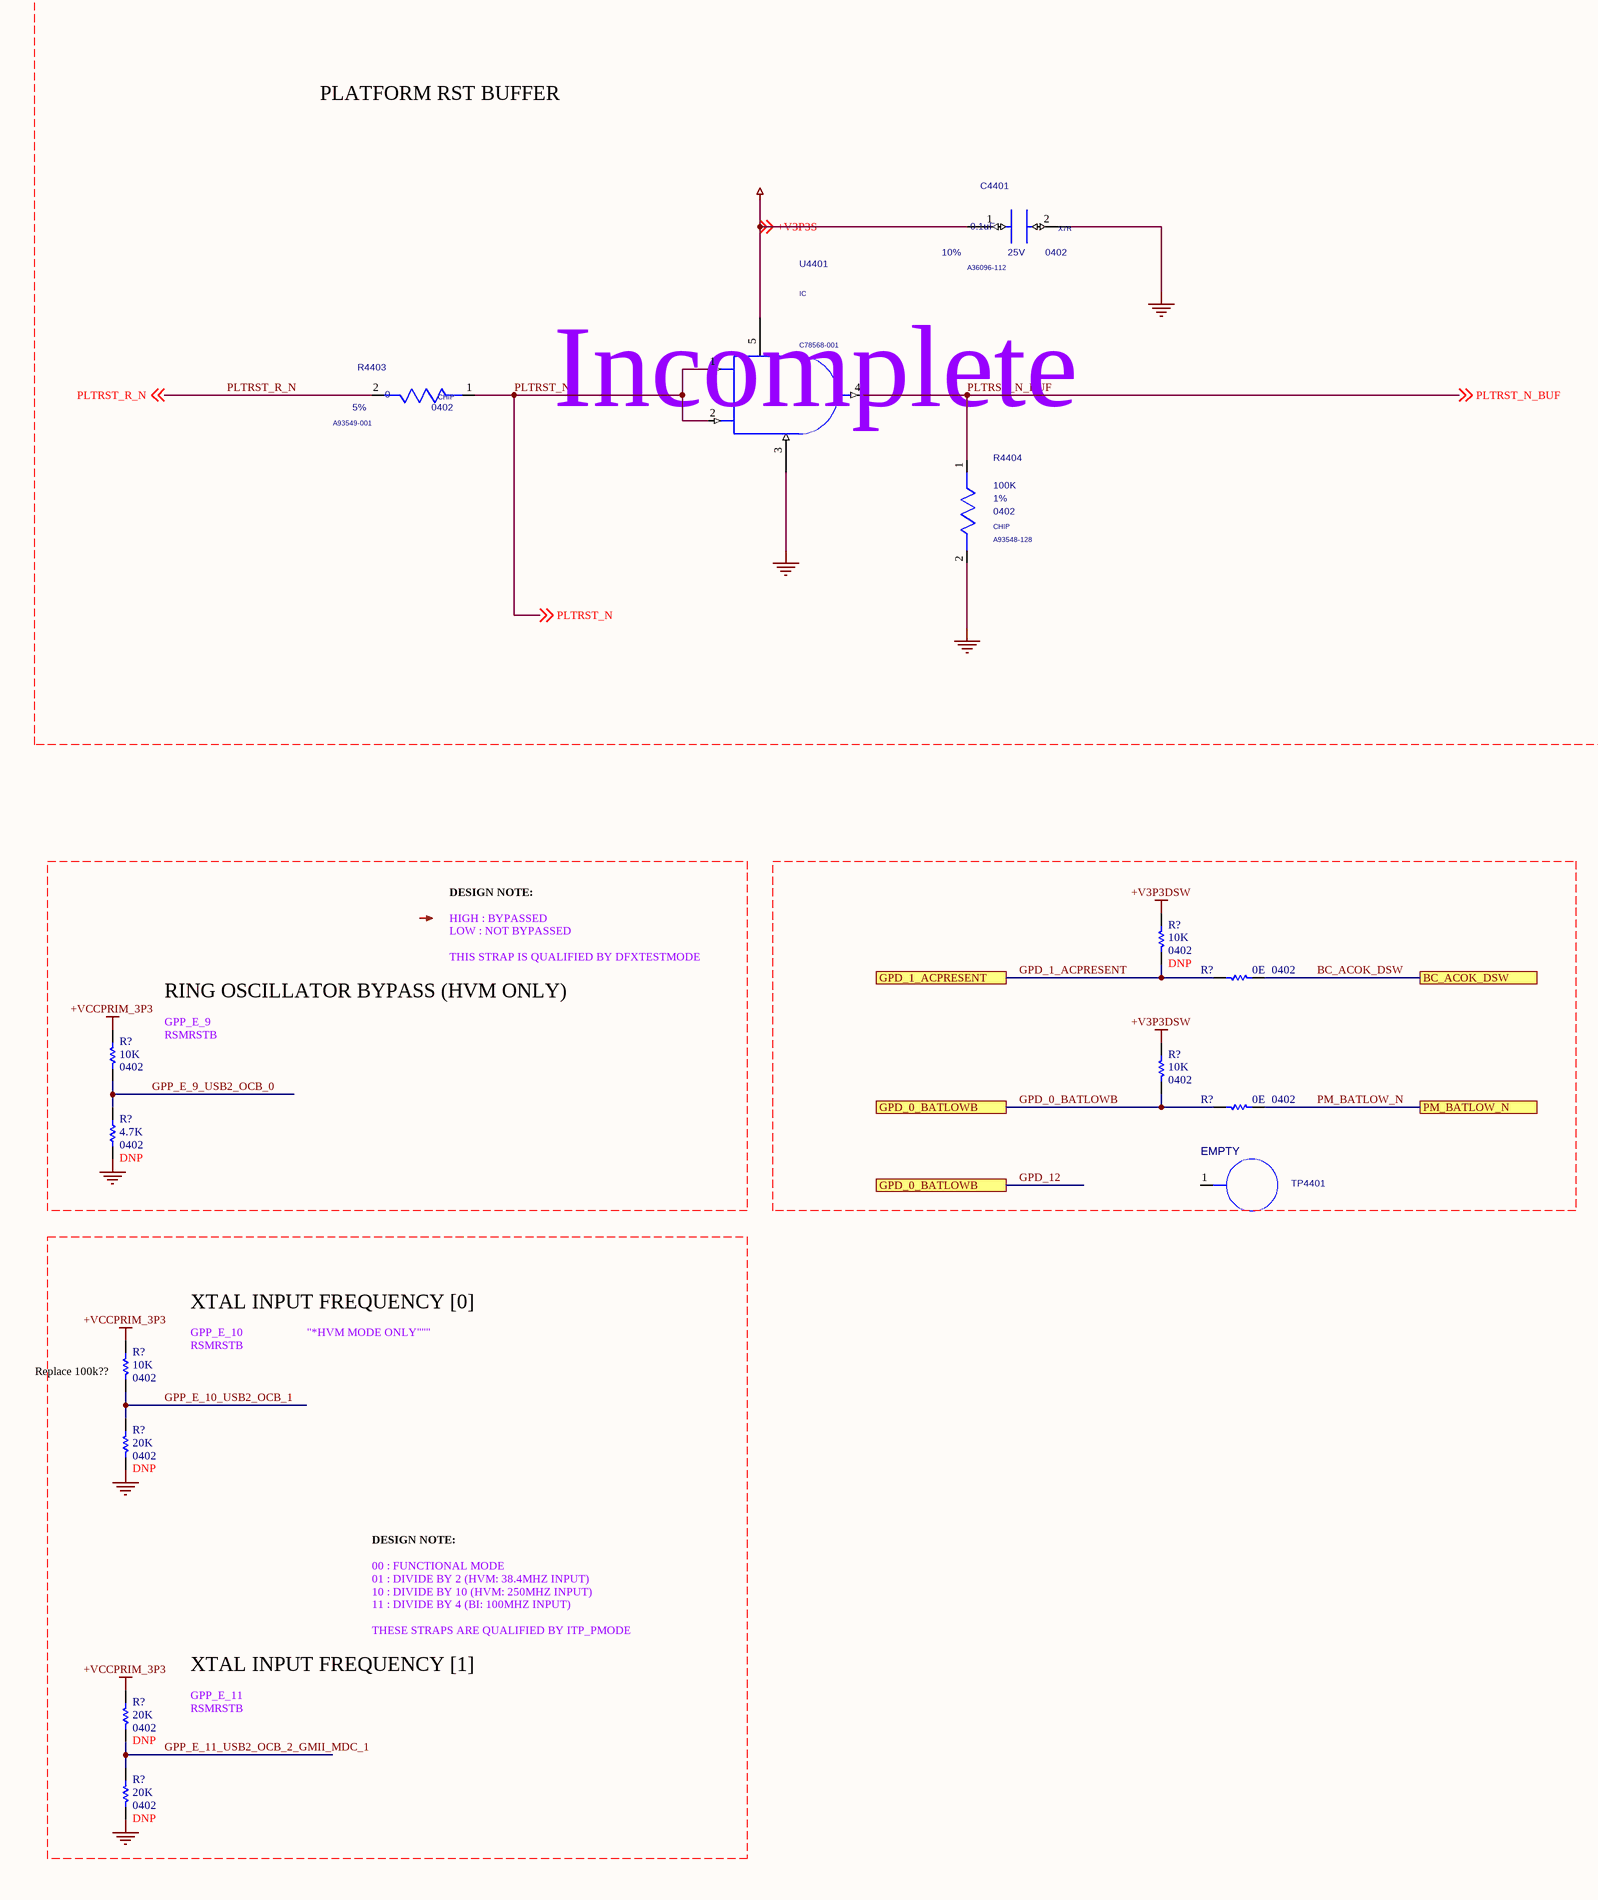
[diagram p74: 0044_RPL PCH H GPIO OPT.SchDoc, left]
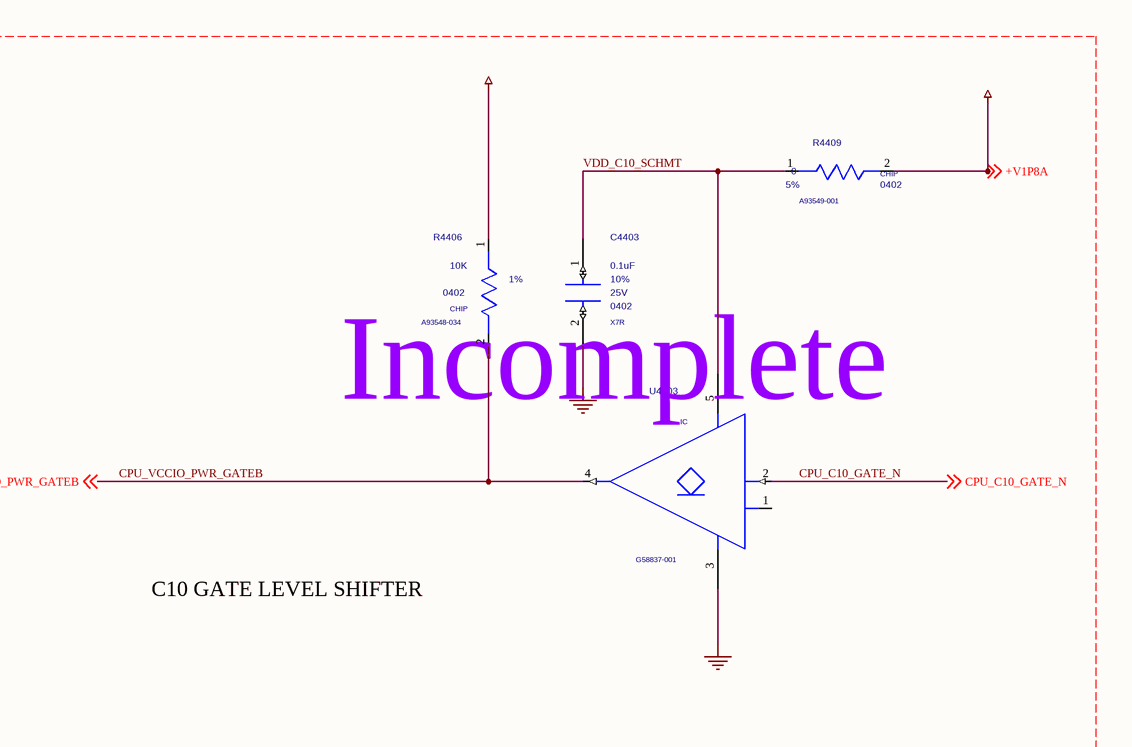
[diagram p75: 0044_RPL PCH H GPIO OPT.SchDoc, right]

### Parts
(Parts that share a designator on the sheet are numbered #1, #2 ... from top to bottom, then left to right.)
C4401  0.1uF  MATERIAL: X7R  PACK_TYPE: 0402  PART_NUMBER: A36096-112  TOLERANCE: 10%  VOLTAGE: 25V  [SMC0402IA]
C4403  0.1uF  MATERIAL: X7R  PACK_TYPE: 0402  TOLERANCE: 10%  VOLTAGE: 25V  [SMC0402IA]
R4403  0  MATERIAL: CHIP  PACK_TYPE: 0402  PART_NUMBER: A93549-001  TOLERANCE: 5%  [SMR0402IA]
R4404  100K  MATERIAL: CHIP  PACK_TYPE: 0402  PART_NUMBER: A93548-128  TOLERANCE: 1%  [SMR0402IA]
R4406  10K  MATERIAL: CHIP  PACK_TYPE: 0402  PART_NUMBER: A93548-034  TOLERANCE: 1%  [SMR0402IA]
R4409  0  MATERIAL: CHIP  PACK_TYPE: 0402  PART_NUMBER: A93549-001  TOLERANCE: 5%  [SMR0402IA]
R?#174  value 10K  Case/Package: 0402  [RESC0402]  (hidden comment: Res)
R?#175  value 0E  Case/Package: 0402  [RESC0402]  (hidden comment: Res)
R?#176  value 10K  Case/Package: 0402  [RESC0402]  (hidden comment: Res)
R?#177  value 10K  Case/Package: 0402  [RESC0402]  (hidden comment: Res)
R?#178  value 0E  Case/Package: 0402  [RESC0402]  (hidden comment: Res)
R?#179  value 4.7K  Case/Package: 0402  [RESC0402]  (hidden comment: Res)
R?#180  value 10K  Case/Package: 0402  [RESC0402]  (hidden comment: Res)
R?#181  value 20K  Case/Package: 0402  [RESC0402]  (hidden comment: Res)
R?#182  value 20K  Case/Package: 0402  [RESC0402]  (hidden comment: Res)
R?#183  value 20K  Case/Package: 0402  [RESC0402]  (hidden comment: Res)
TP4401  MATERIAL: EMPTY  [TPS16]  (hidden comment: TP20)
U4401  MATERIAL: IC  PART_NUMBER: C78568-001  [SOT23_5ME]  (hidden comment: TTL1G08)
U4403  MATERIAL: IC  PART_NUMBER: G58837-001  [TSSOP5_21X13_65MA]  (hidden comment: TTL07)

### Ports
BC_ACOK_DSW, GPD_0_BATLOWB, GPD_1_ACPRESENT, PM_BATLOW_N

### Nets
+V1P8A: R4409.2(B) ; off-sheet +V1P8A
+V3P3A: R4406.1(A)
+V3P3DSW: R?#174.2 R?#177.2
+V3P3S: C4401.1(A) U4401.5(VCC) ; off-sheet +V3P3S
+VCCPRIM_3P3: R?#176.2 R?#180.2 R?#182.2
GND: C4401.2(B) C4403.2(B) R4404.2(B) R?#179.1 R?#181.1 R?#183.1 U4401.3(GND) U4403.3(GND)  [project net EXP_A_RX_4_DP]
BC_ACOK_DSW: R?#175.2 ; port BC_ACOK_DSW
CPU_C10_GATE_N: U4403.2(A) ; off-sheet CPU_C10_GATE_N
CPU_VCCIO_PWR_GATEB: R4406.2(B) U4403.4(Y) ; off-sheet CPU_VCCIO_PWR_GATEB
GPD_0_BATLOWB: R?#177.1 R?#178.1 ; port GPD_0_BATLOWB  [also labelled GPD_12]
GPD_1_ACPRESENT: R?#174.1 R?#175.1 ; port GPD_1_ACPRESENT
GPP_E_9_USB2_OCB_0: R?#176.1 R?#179.2
GPP_E_10_USB2_OCB_1: R?#180.1 R?#181.2
GPP_E_11_USB2_OCB_2_GMII_MDC_1: R?#182.1 R?#183.2
PLTRST_N: R4403.1(A) U4401.1(A) U4401.2(B) ; off-sheet PLTRST_N
PLTRST_N_BUF: R4404.1(A) U4401.4(Y) ; off-sheet PLTRST_N_BUF
PLTRST_R_N: R4403.2(B) ; off-sheet PLTRST_R_N
PM_BATLOW_N: R?#178.2 ; port PM_BATLOW_N
VDD_C10_SCHMT: C4403.1(A) R4409.1(A) U4403.5(VCC)

Not connected (* = marked no-connect by the designer): TP4401 1(TP); U4403 1(NC)

### Notes on the sheet
- PLATFORM RST BUFFER
- Incomplete
- (near U4401) Incomplete
- C10 GATE LEVEL SHIFTER
- DESIGN NOTE:
- LOW : NOT BYPASSED
- HIGH : BYPASSED
- THIS STRAP IS QUALIFIED BY DFXTESTMODE
- GPP_E_9
- RING OSCILLATOR BYPASS (HVM ONLY)
- RSMRSTB
- GPP_E_10
- XTAL INPUT FREQUENCY [0]
- "*HVM MODE ONLY"""
- (near R?#180) Replace 100k??
- 11 : DIVIDE BY 4 (BI: 100MHZ INPUT)
- 10 : DIVIDE BY 10 (HVM: 250MHZ INPUT)
- 01 : DIVIDE BY 2 (HVM: 38.4MHZ INPUT)
- 00 : FUNCTIONAL MODE
- XTAL INPUT FREQUENCY [1]
- THESE STRAPS ARE QUALIFIED BY ITP_PMODE
- GPP_E_11

### Library data of the parts
C4401 = CAP#1: CHIPS_PART_NAME: CAP; CDS_PHYS_PART_NAME: CAP_0402-A36096-112,X7R,0.1UF,25V,10%,LPDB,GENERIC; OriginalSymbolOrigin: (-25,50); XY: (4400,4150); VER: 2; ROT: 0; PHYS_PAGE: 44; LOCATION: C4401; IP: GENERIC; FP_TECH: LPDB; DRAWING: @RVP1_ADL_SB_ADP_S_DDR5_SODIMM_2DPC_LIB.H55_DG2_2DPC(SCH_1):PAGE44; CDS_LIB: discrete; PCB Footprint: SMC0402IA; CDS_PART_NAME: CAP_0402-A36096-112,X7R,0.1UF,25V,10%,LPDB,GENERIC; CDS_LOCATION: C4401; ASI_MODEL: A36096-112
C4403 = CAP: PART_NUMBER: A36096-112; CDS_PHYS_PART_NAME: CAP_0402-A36096-112,X7R,0.1UF,25V,10%,LPDB,GENERIC; OriginalSymbolOrigin: (-50,25); XY: (8175,3775); VER: 1; ROT: 0; PHYS_PAGE: 44; LOCATION: C4403; IP: GENERIC; FP_TECH: LPDB; DRAWING: @RVP1_ADL_SB_ADP_S_DDR5_SODIMM_2DPC_LIB.H55_DG2_2DPC(SCH_1):PAGE44; CDS_LIB: discrete; PCB Footprint: SMC0402IA; CHIPS_PART_NAME: CAP; CDS_PART_NAME: CAP_0402-A36096-112,X7R,0.1UF,25V,10%,LPDB,GENERIC; CDS_LOCATION: C4403; ASI_MODEL: A36096-112
R4403 = RES#1: CHIPS_PART_NAME: RES; CDS_PHYS_PART_NAME: RES_0402-A93549-001,CHIP,0,5%,1/16W,LPDB,GENERIC; WATTAGE: 1/16W; OriginalSymbolOrigin: (-75,25); XY: (3250,3825); VER: 1; ROT: 2; PHYS_PAGE: 44; LOCATION: R4403; IP: GENERIC; FP_TECH: LPDB; FIN: SPI; DRAWING: @RVP1_ADL_SB_ADP_S_DDR5_SODIMM_2DPC_LIB.H55_DG2_2DPC(SCH_1):PAGE44; CDS_LIB: discrete; PCB Footprint: SMR0402IA; CDS_PART_NAME: RES_0402-A93549-001,CHIP,0,5%,1/16W,LPDB,GENERIC; CDS_LOCATION: R4403; ASI_MODEL: A93549-001
R4404 = RES: CDS_PHYS_PART_NAME: RES_0402-A93548-128,CHIP,100K,1%,1/16W,LPDB,GENERIC; WATTAGE: 1/16W; OriginalSymbolOrigin: (-25,75); XY: (4300,3600); VER: 2; ROT: 0; PHYS_PAGE: 44; LOCATION: R4404; IP: GENERIC; FP_TECH: LPDB; DRAWING: @RVP1_ADL_SB_ADP_S_DDR5_SODIMM_2DPC_LIB.H55_DG2_2DPC(SCH_1):PAGE44; CDS_LIB: discrete; PCB Footprint: SMR0402IA; CHIPS_PART_NAME: RES; CDS_PART_NAME: RES_0402-A93548-128,CHIP,100K,1%,1/16W,LPDB,GENERIC; CDS_LOCATION: R4404; ASI_MODEL: A93548-128
R4406 = RES: CDS_PHYS_PART_NAME: RES_0402-A93548-034,CHIP,10K,1%,1/16W,LPDB,GENERIC; WATTAGE: 1/16W; OriginalSymbolOrigin: (-25,75); XY: (8000,3775); VER: 2; ROT: 0; PHYS_PAGE: 44; LOCATION: R4406; IP: GENERIC; FP_TECH: LPDB; DRAWING: @RVP1_ADL_SB_ADP_S_DDR5_SODIMM_2DPC_LIB.H55_DG2_2DPC(SCH_1):PAGE44; CDS_LIB: discrete; PCB Footprint: SMR0402IA; CHIPS_PART_NAME: RES; CDS_PART_NAME: RES_0402-A93548-034,CHIP,10K,1%,1/16W,LPDB,GENERIC; CDS_LOCATION: R4406; ASI_MODEL: A93548-034
R4409 = RES#1: CHIPS_PART_NAME: RES; CDS_PHYS_PART_NAME: RES_0402-A93549-001,CHIP,0,5%,1/16W,LPDB,GENERIC; WATTAGE: 1/16W; OriginalSymbolOrigin: (-75,25); XY: (8650,4000); VER: 1; PHYS_PAGE: 44; LOCATION: R4409; IP: GENERIC; FP_TECH: LPDB; DRAWING: @RVP1_ADL_SB_ADP_S_DDR5_SODIMM_2DPC_LIB.H55_DG2_2DPC(SCH_1):PAGE44; CDS_LIB: discrete; PCB Footprint: SMR0402IA; ROT: 0; CDS_PART_NAME: RES_0402-A93549-001,CHIP,0,5%,1/16W,LPDB,GENERIC; CDS_LOCATION: R4409; ASI_MODEL: A93549-001
R?#174 R?#176 R?#177 R?#180 = Res: Thick Film Resistor -  10Kohm, 1%, 0402
  R?#174: DNP: DNP
R?#175 R?#178 = Res: Thick Film Resistor -  0ohm, 1%, 0402
R?#179 = Res: Thick Film Resistor -  4.7Kohm, 1%, 0402; DNP: DNP
R?#181-R?#183 = Res: Thick Film Resistor -  20Kohm, 1%, 0402; DNP: DNP
TP4401 = TP#1: PART_NUMBER: NA_TPS16; CHIPS_PART_NAME: TP; CDS_PHYS_PART_NAME: TP_SM-NA_TPS16,EMPTY,TPS16,LPDB,GENERIC; CDS_LMAN_SYM_OUTLINE: -50,50,50,-50; PACK_TYPE: SM; OriginalSymbolOrigin: (-50,75); XY: (9525,1325); VER: 3; ROT: 1; PHYS_PAGE: 44; LOCATION: TP4401; IP: GENERIC; FP_TECH: LPDB; DRAWING: @RVP1_ADL_SB_ADP_S_DDR5_SODIMM_2DPC_LIB.H55_DG2_2DPC(SCH_1):PAGE44; CDS_LIB: board_artifacts; PCB Footprint: TPS16; CDS_PART_NAME: TP_SM-NA_TPS16,EMPTY,TPS16,LPDB,GENERIC; CDS_LOCATION: TP4401; ASI_MODEL: NA_TPS16
U4401 = TTL1G08: CDS_PHYS_PART_NAME: TTL1G08_SM-C78568-001,IC,74AHC1G08,LPDB,GENERIC; CDS_LMAN_SYM_OUTLINE: -100,100,100,-100"; PACK_TYPE: SM; OriginalSymbolOrigin: (-125,75); XY: (3950,3825); VER: 1; ROT: 0; PHYS_PAGE: 44; LOCATION: U4401; IP: GENERIC; FP_TECH: LPDB; DRAWING: @RVP1_ADL_SB_ADP_S_DDR5_SODIMM_2DPC_LIB.H55_DG2_2DPC(SCH_1):PAGE44; CDS_LIB: ttl; PCB Footprint: SOT23_5ME; SEC_TYPE: SM; CHIPS_PART_NAME: TTL1G08; CDS_PART_NAME: TTL1G08_SM-C78568-001,IC,74AHC1G08,LPDB,GENERIC; CDS_LOCATION: U4401; ASI_MODEL: C78568-001
U4403 = TTL07: CDS_PHYS_PART_NAME: TTL07_SM-G58837-001,IC,74AUP1G07GW,LPDB,GENERIC; CDS_LMAN_SYM_OUTLINE: -100,150,150,-150"; PACK_TYPE: SM; OriginalSymbolOrigin: (-125,125); XY: (8375,3425); VER: 1; ROT: 2; PHYS_PAGE: 44; LOCATION: U4403; IP: GENERIC; FP_TECH: LPDB; DRAWING: @RVP1_ADL_SB_ADP_S_DDR5_SODIMM_2DPC_LIB.H55_DG2_2DPC(SCH_1):PAGE44; CDS_LIB: ttl; PCB Footprint: TSSOP5_21X13_65MA; CHIPS_PART_NAME: TTL07; CDS_PART_NAME: TTL07_SM-G58837-001,IC,74AUP1G07GW,LPDB,GENERIC; CDS_LOCATION: U4403; ASI_MODEL: G58837-001